# Altium project Power_Box_V2.PrjPcb (part 1 of 2)
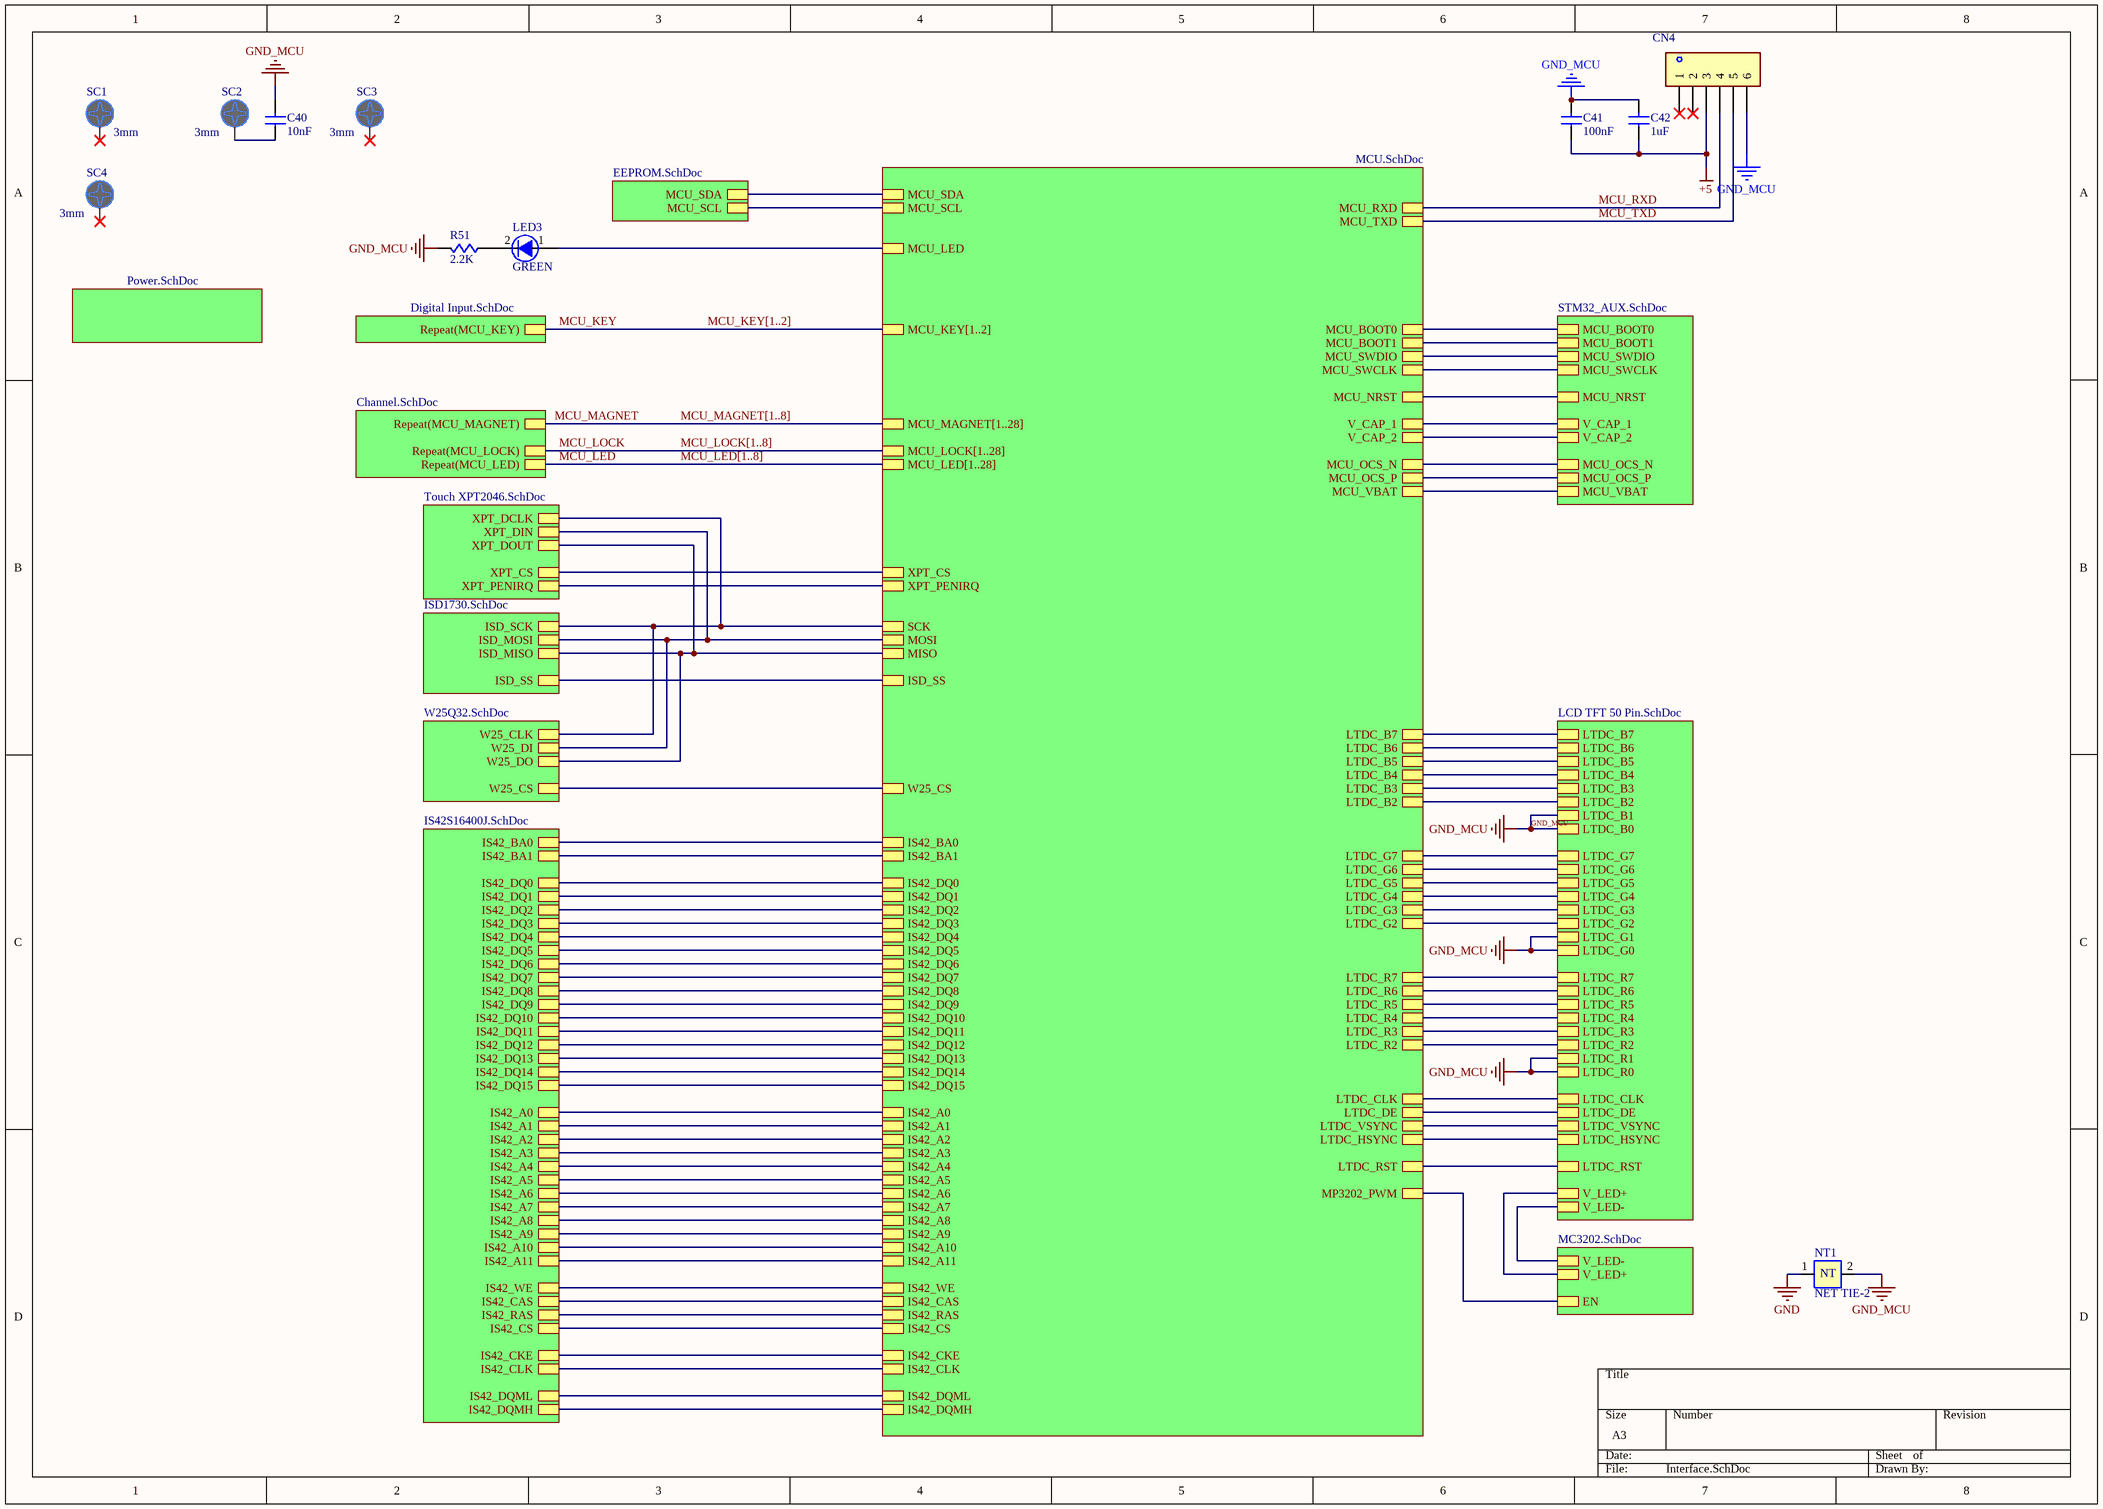
[diagram p0: Interface.SchDoc]
13 sheets, 240 parts. Net scope: hierarchical (ports join the sheet entries above them; power ports are global).
Board file: Power_Box_V2.PcbDoc
Sheets:
  Interface.SchDoc
    MCU = MCU.SchDoc
    STM_AUX = STM32_AUX.SchDoc
    TFT = LCD TFT 50 Pin.SchDoc
    W25Q32 = W25Q32.SchDoc
    EEPROM = EEPROM.SchDoc
    KEY1 = Digital Input.SchDoc
    KEY2 = Digital Input.SchDoc
    Power = Power.SchDoc
    CHANNEL1 = Channel.SchDoc
    CHANNEL2 = Channel.SchDoc
    CHANNEL3 = Channel.SchDoc
    CHANNEL4 = Channel.SchDoc
    CHANNEL5 = Channel.SchDoc
    CHANNEL6 = Channel.SchDoc
    CHANNEL7 = Channel.SchDoc
    CHANNEL8 = Channel.SchDoc
    MC3202 = MC3202.SchDoc
    ISD1730 = ISD1730.SchDoc
    IS42S16400J = IS42S16400J.SchDoc
    XPT2046 = Touch XPT2046.SchDoc

## Sheet Interface.SchDoc
size A3; SheetNumber: 1; SheetTotal: 13

### Parts
C40  value 10nF  [CAP-CER-7x2.5-Ls5]  (hidden comment: CAP Cer 10nF-1KV-X7R-THD)
C41  value 100nF  [C-0805]  (hidden comment: CAP Cer 100nF-50V-X7R-SMD)
C42  value 1uF  [C-0805]  (hidden comment: CAP Cer 1uF-50V-X7R-SMD)
CN4  Connector XH-Straight-THD-2.54mm  [XH-6]  (value not drawn)
LED3  Color: GREEN  [LED-1206-Y]  (hidden comment: LED GREEN-1206-SMD)
NT1  NET TIE-2  [NET TIE-2]  (net tie, no BOM)
R51  value 2.2K  [R-0805]  (hidden comment: RES 2.2K-5%-1/8W-SMD)
SC1  Size: 3mm  [Screw_M3]  (hidden comment: Screw 3mm)
SC2  Size: 3mm  [Screw_M3]  (hidden comment: Screw 3mm)
SC3  Size: 3mm  [Screw_M3]  (hidden comment: Screw 3mm)
SC4  Size: 3mm  [Screw_M3]  (hidden comment: Screw 3mm)

### Sub-sheets
EEPROM = EEPROM.SchDoc: MCU_SDA, MCU_SCL
IS42S16400J = IS42S16400J.SchDoc: IS42_BA0, IS42_BA1, IS42_DQ0, IS42_DQ1, IS42_DQ2, IS42_DQ3, IS42_DQ4, IS42_DQ5, IS42_DQ6, IS42_DQ7, IS42_DQ8, IS42_DQ9, IS42_DQ10, IS42_DQ11, IS42_DQ12, IS42_DQ13, IS42_DQ14, IS42_DQ15, IS42_A0, IS42_A1, IS42_A2, IS42_A3, IS42_A4, IS42_A5, IS42_A6, IS42_A7, IS42_A8, IS42_A9, IS42_A10, IS42_A11, IS42_WE, IS42_CAS, IS42_RAS, IS42_CS, IS42_CKE, IS42_CLK, IS42_DQML, IS42_DQMH
ISD1730 = ISD1730.SchDoc: ISD_SCK, ISD_MOSI, ISD_MISO, ISD_SS
MC3202 = MC3202.SchDoc: V_LED-, V_LED+, EN
MCU = MCU.SchDoc: MCU_BOOT0, MCU_SWCLK, MCU_SWDIO, MCU_NRST, MCU_OCS_N, MCU_OCS_P, MCU_SDA, MCU_SCL, MCU_KEY[1..2], MCU_LOCK[1..28], MCU_LED[1..28], MCU_MAGNET[1..28], MCU_TXD, MCU_RXD, MCU_VBAT, MCU_LED, LTDC_B2, LTDC_B3, LTDC_B4, LTDC_B5, LTDC_B6, LTDC_B7, LTDC_G2, LTDC_G3, LTDC_G4, LTDC_G5, LTDC_G6, LTDC_G7, LTDC_R2, LTDC_R3, LTDC_R4, LTDC_R5, LTDC_R6, LTDC_R7, LTDC_CLK, LTDC_DE, LTDC_VSYNC, LTDC_HSYNC, LTDC_RST, MP3202_PWM, SCK, MOSI, MISO, ISD_SS, W25_CS, IS42_BA0, IS42_BA1, IS42_DQ0, IS42_DQ1, IS42_DQ2, IS42_DQ3, IS42_DQ4, IS42_DQ5, IS42_DQ6, IS42_DQ7, IS42_DQ8, IS42_DQ9, IS42_DQ10, IS42_DQ11, IS42_DQ12, IS42_DQ13, IS42_DQ14, IS42_DQ15, IS42_A0, IS42_A1, IS42_A2, IS42_A3, IS42_A4, IS42_A5, IS42_A6, IS42_A7, IS42_A8, IS42_A9, IS42_A10, IS42_A11, IS42_WE, IS42_CAS, IS42_RAS, IS42_CS, IS42_CKE, IS42_CLK, IS42_DQML, IS42_DQMH, MCU_BOOT1, V_CAP_1, V_CAP_2, XPT_CS, XPT_PENIRQ
Power = Power.SchDoc: no entries
Repeat(CHANNEL, 1, 8) = Channel.SchDoc: Repeat(MCU_LOCK), Repeat(MCU_LED), Repeat(MCU_MAGNET)
Repeat(KEY, 1, 2) = Digital Input.SchDoc: Repeat(MCU_KEY)
STM_AUX = STM32_AUX.SchDoc: MCU_BOOT0, MCU_SWCLK, MCU_SWDIO, MCU_NRST, MCU_OCS_N, MCU_OCS_P, MCU_VBAT, MCU_BOOT1, V_CAP_1, V_CAP_2
TFT = LCD TFT 50 Pin.SchDoc: LTDC_B0, LTDC_B1, LTDC_B2, LTDC_B3, LTDC_B4, LTDC_B5, LTDC_B6, LTDC_B7, LTDC_G0, LTDC_G1, LTDC_G2, LTDC_G3, LTDC_G4, LTDC_G5, LTDC_G6, LTDC_G7, LTDC_R0, LTDC_R1, LTDC_R2, LTDC_R3, LTDC_R4, LTDC_R5, LTDC_R6, LTDC_R7, LTDC_CLK, LTDC_DE, LTDC_VSYNC, LTDC_HSYNC, LTDC_RST, V_LED+, V_LED-
W25Q32 = W25Q32.SchDoc: W25_CLK, W25_DO, W25_DI, W25_CS
XPT2046 = Touch XPT2046.SchDoc: XPT_DCLK, XPT_DIN, XPT_DOUT, XPT_CS, XPT_PENIRQ

### Nets
+5: C41.1 C42.1 CN4.3
GND: NT1.1
GND_MCU: C40.2 C41.2 C42.2 CN4.6 NT1.2 R51.2 ; sheet TFT/LTDC_B0, sheet TFT/LTDC_B1, sheet TFT/LTDC_G0, sheet TFT/LTDC_G1, sheet TFT/LTDC_R0, sheet TFT/LTDC_R1
LTDC_B2: sheet MCU/LTDC_B2, sheet TFT/LTDC_B2
LTDC_B3: sheet MCU/LTDC_B3, sheet TFT/LTDC_B3
LTDC_B4: sheet MCU/LTDC_B4, sheet TFT/LTDC_B4
LTDC_B5: sheet MCU/LTDC_B5, sheet TFT/LTDC_B5
LTDC_B6: sheet MCU/LTDC_B6, sheet TFT/LTDC_B6
LTDC_B7: sheet MCU/LTDC_B7, sheet TFT/LTDC_B7
LTDC_CLK: sheet MCU/LTDC_CLK, sheet TFT/LTDC_CLK
LTDC_DE: sheet MCU/LTDC_DE, sheet TFT/LTDC_DE
LTDC_G2: sheet MCU/LTDC_G2, sheet TFT/LTDC_G2
LTDC_G3: sheet MCU/LTDC_G3, sheet TFT/LTDC_G3
LTDC_G4: sheet MCU/LTDC_G4, sheet TFT/LTDC_G4
LTDC_G5: sheet MCU/LTDC_G5, sheet TFT/LTDC_G5
LTDC_G6: sheet MCU/LTDC_G6, sheet TFT/LTDC_G6
LTDC_G7: sheet MCU/LTDC_G7, sheet TFT/LTDC_G7
LTDC_HSYNC: sheet MCU/LTDC_HSYNC, sheet TFT/LTDC_HSYNC
LTDC_R2: sheet MCU/LTDC_R2, sheet TFT/LTDC_R2
LTDC_R3: sheet MCU/LTDC_R3, sheet TFT/LTDC_R3
LTDC_R4: sheet MCU/LTDC_R4, sheet TFT/LTDC_R4
LTDC_R5: sheet MCU/LTDC_R5, sheet TFT/LTDC_R5
LTDC_R6: sheet MCU/LTDC_R6, sheet TFT/LTDC_R6
LTDC_R7: sheet MCU/LTDC_R7, sheet TFT/LTDC_R7
LTDC_RST: sheet MCU/LTDC_RST, sheet TFT/LTDC_RST
LTDC_VSYNC: sheet MCU/LTDC_VSYNC, sheet TFT/LTDC_VSYNC
MCU_BOOT0: sheet MCU/MCU_BOOT0, sheet STM_AUX/MCU_BOOT0
MCU_BOOT1: sheet MCU/MCU_BOOT1, sheet STM_AUX/MCU_BOOT1
MCU_KEY: sheet Repeat(KEY, 1, 2)/Repeat(MCU_KEY)  [also labelled MCU_KEY[1..2]]
MCU_LED: sheet Repeat(CHANNEL, 1, 8)/Repeat(MCU_LED)
MCU_LOCK: sheet Repeat(CHANNEL, 1, 8)/Repeat(MCU_LOCK)
MCU_MAGNET: sheet Repeat(CHANNEL, 1, 8)/Repeat(MCU_MAGNET)
MCU_NRST: sheet MCU/MCU_NRST, sheet STM_AUX/MCU_NRST
MCU_OCS_N: sheet MCU/MCU_OCS_N, sheet STM_AUX/MCU_OCS_N
MCU_OCS_P: sheet MCU/MCU_OCS_P, sheet STM_AUX/MCU_OCS_P
MCU_RXD: CN4.4 ; sheet MCU/MCU_RXD
MCU_SCL: sheet MCU/MCU_SCL, sheet EEPROM/MCU_SCL
MCU_SDA: sheet MCU/MCU_SDA, sheet EEPROM/MCU_SDA
MCU_SWCLK: sheet MCU/MCU_SWCLK, sheet STM_AUX/MCU_SWCLK
MCU_SWDIO: sheet MCU/MCU_SWDIO, sheet STM_AUX/MCU_SWDIO
MCU_TXD: CN4.5 ; sheet MCU/MCU_TXD
MCU_VBAT: sheet MCU/MCU_VBAT, sheet STM_AUX/MCU_VBAT
V_CAP_1: sheet MCU/V_CAP_1, sheet STM_AUX/V_CAP_1
V_CAP_2: sheet MCU/V_CAP_2, sheet STM_AUX/V_CAP_2
V_LED+: sheet TFT/V_LED+, sheet MC3202/V_LED+
V_LED-: sheet TFT/V_LED-, sheet MC3202/V_LED-
NetC40_1: C40.1 SC2.1
NetLED3_1: LED3.1(A) ; sheet MCU/MCU_LED
NetLED3_2: LED3.2(C) R51.1
NetR53_1: sheet MCU/MP3202_PWM, sheet MC3202/EN
NetR56_1: sheet MCU/W25_CS, sheet W25Q32/W25_CS
NetR59_1: sheet MCU/IS42_CLK, sheet IS42S16400J/IS42_CLK
NetR60_1: sheet MCU/XPT_PENIRQ, sheet XPT2046/XPT_PENIRQ
NetR61_1: sheet MCU/XPT_CS, sheet XPT2046/XPT_CS
NetU2_4: sheet MCU/MISO, sheet W25Q32/W25_DO, sheet ISD1730/ISD_MISO, sheet XPT2046/XPT_DOUT
NetU2_5: sheet MCU/MOSI, sheet W25Q32/W25_DI, sheet ISD1730/ISD_MOSI, sheet XPT2046/XPT_DIN
NetU2_6: sheet MCU/SCK, sheet W25Q32/W25_CLK, sheet ISD1730/ISD_SCK, sheet XPT2046/XPT_DCLK
NetU2_7: sheet MCU/ISD_SS, sheet ISD1730/ISD_SS
NetU3_10: sheet MCU/IS42_A0, sheet IS42S16400J/IS42_A0
NetU3_11: sheet MCU/IS42_A1, sheet IS42S16400J/IS42_A1
NetU3_12: sheet MCU/IS42_A2, sheet IS42S16400J/IS42_A2
NetU3_13: sheet MCU/IS42_A3, sheet IS42S16400J/IS42_A3
NetU3_14: sheet MCU/IS42_A4, sheet IS42S16400J/IS42_A4
NetU3_15: sheet MCU/IS42_A5, sheet IS42S16400J/IS42_A5
NetU3_26: sheet MCU/IS42_WE, sheet IS42S16400J/IS42_WE
NetU3_28: sheet MCU/IS42_CS, sheet IS42S16400J/IS42_CS
NetU3_29: sheet MCU/IS42_CKE, sheet IS42S16400J/IS42_CKE
NetU3_49: sheet MCU/IS42_RAS, sheet IS42S16400J/IS42_RAS
NetU3_50: sheet MCU/IS42_A6, sheet IS42S16400J/IS42_A6
NetU3_53: sheet MCU/IS42_A7, sheet IS42S16400J/IS42_A7
NetU3_54: sheet MCU/IS42_A8, sheet IS42S16400J/IS42_A8
NetU3_55: sheet MCU/IS42_A9, sheet IS42S16400J/IS42_A9
NetU3_56: sheet MCU/IS42_A10, sheet IS42S16400J/IS42_A10
NetU3_57: sheet MCU/IS42_A11, sheet IS42S16400J/IS42_A11
NetU3_58: sheet MCU/IS42_DQ4, sheet IS42S16400J/IS42_DQ4
NetU3_59: sheet MCU/IS42_DQ5, sheet IS42S16400J/IS42_DQ5
NetU3_60: sheet MCU/IS42_DQ6, sheet IS42S16400J/IS42_DQ6
NetU3_63: sheet MCU/IS42_DQ7, sheet IS42S16400J/IS42_DQ7
NetU3_64: sheet MCU/IS42_DQ8, sheet IS42S16400J/IS42_DQ8
NetU3_65: sheet MCU/IS42_DQ9, sheet IS42S16400J/IS42_DQ9
NetU3_66: sheet MCU/IS42_DQ10, sheet IS42S16400J/IS42_DQ10
NetU3_67: sheet MCU/IS42_DQ11, sheet IS42S16400J/IS42_DQ11
NetU3_68: sheet MCU/IS42_DQ12, sheet IS42S16400J/IS42_DQ12
NetU3_77: sheet MCU/IS42_DQ13, sheet IS42S16400J/IS42_DQ13
NetU3_78: sheet MCU/IS42_DQ14, sheet IS42S16400J/IS42_DQ14
NetU3_79: sheet MCU/IS42_DQ15, sheet IS42S16400J/IS42_DQ15
NetU3_85: sheet MCU/IS42_DQ0, sheet IS42S16400J/IS42_DQ0
NetU3_86: sheet MCU/IS42_DQ1, sheet IS42S16400J/IS42_DQ1
NetU3_89: sheet MCU/IS42_BA1, sheet IS42S16400J/IS42_BA1
NetU3_90: sheet MCU/IS42_BA0, sheet IS42S16400J/IS42_BA0
NetU3_114: sheet MCU/IS42_DQ2, sheet IS42S16400J/IS42_DQ2
NetU3_115: sheet MCU/IS42_DQ3, sheet IS42S16400J/IS42_DQ3
NetU3_132: sheet MCU/IS42_CAS, sheet IS42S16400J/IS42_CAS
NetU3_141: sheet MCU/IS42_DQML, sheet IS42S16400J/IS42_DQML
NetU3_142: sheet MCU/IS42_DQMH, sheet IS42S16400J/IS42_DQMH

Not connected (* = marked no-connect by the designer): CN4 1* 2*; SC1 1*; SC3 1*; SC4 1*

### Buses and harness runs
bus MCU_LED[1..8] = sheet MCU/MCU_LED[1..28]
bus MCU_LOCK[1..8] = sheet MCU/MCU_LOCK[1..28]
bus MCU_MAGNET[1..8] = sheet MCU/MCU_MAGNET[1..28]

### Notes on the sheet
- (in symbol NET TIE-2) NT

### Library data of the parts
C40 = CAP-CER: CAPACITOR; Phone Number: 0915 8700 314; Voltage: 1KV; Tolerance: X7R; Type: THD; Publisher: Mahdi Bagherzadeh; ComponentLink1Description: Linkedin; ComponentLink1URL: https://ir.linkedin.com/in/mahdi-bagherzade; Published Date: 9-15-2024
C41 C42 = CAP-CER: CAPACITOR; Phone Number: 0915 8700 314; Voltage: 50V; Tolerance: X7R; Type: SMD; Publisher: Mahdi Bagherzadeh; ComponentLink1Description: Linkedin; ComponentLink1URL: https://ir.linkedin.com/in/mahdi-bagherzade; Published Date: 9-15-2024
CN4 = CN-6pin: CONNECTOR; Phone Number: 0915 8700 314; Value: XH; Publisher: Mahdi Bagherzadeh; ComponentLink1Description: Linkedin; ComponentLink1URL: https://ir.linkedin.com/in/mahdi-bagherzade; Published Date: 9-15-2024; Size: 2.54mm; Type: Straight-THD
LED3 = LED: Phone Number: 0915 8700 314; Type: SMD; Publisher: Mahdi Bagherzadeh; ComponentLink1Description: Linkedin; ComponentLink1URL: https://ir.linkedin.com/in/mahdi-bagherzade; Published Date: 9-15-2024; Size: 1206
NT1 = NET TIE-2: Phone Number: 0915 8700 314; Publisher: Mahdi Bagherzadeh; ComponentLink1Description: Linkedin; ComponentLink1URL: https://ir.linkedin.com/in/mahdi-bagherzade; Published Date: 9-15-2024
R51 = RES: RESISTOR; Phone Number: 0915 8700 314; Tolerance: 5%; Power: 1/8W; Publisher: Mahdi Bagherzadeh; ComponentLink1Description: Linkedin; ComponentLink1URL: https://ir.linkedin.com/in/mahdi-bagherzade; Published Date: 9-15-2024; Type: SMD
SC1-SC4 = SCREW: Phone Number: 0915 8700 314; Publisher: Mahdi Bagherzadeh; ComponentLink1Description: Linkedin; ComponentLink1URL: https://ir.linkedin.com/in/mahdi-bagherzade; Published Date: 9-15-2024

## Sheet MCU.SchDoc
size A3; SheetNumber: 7; SheetTotal: 13
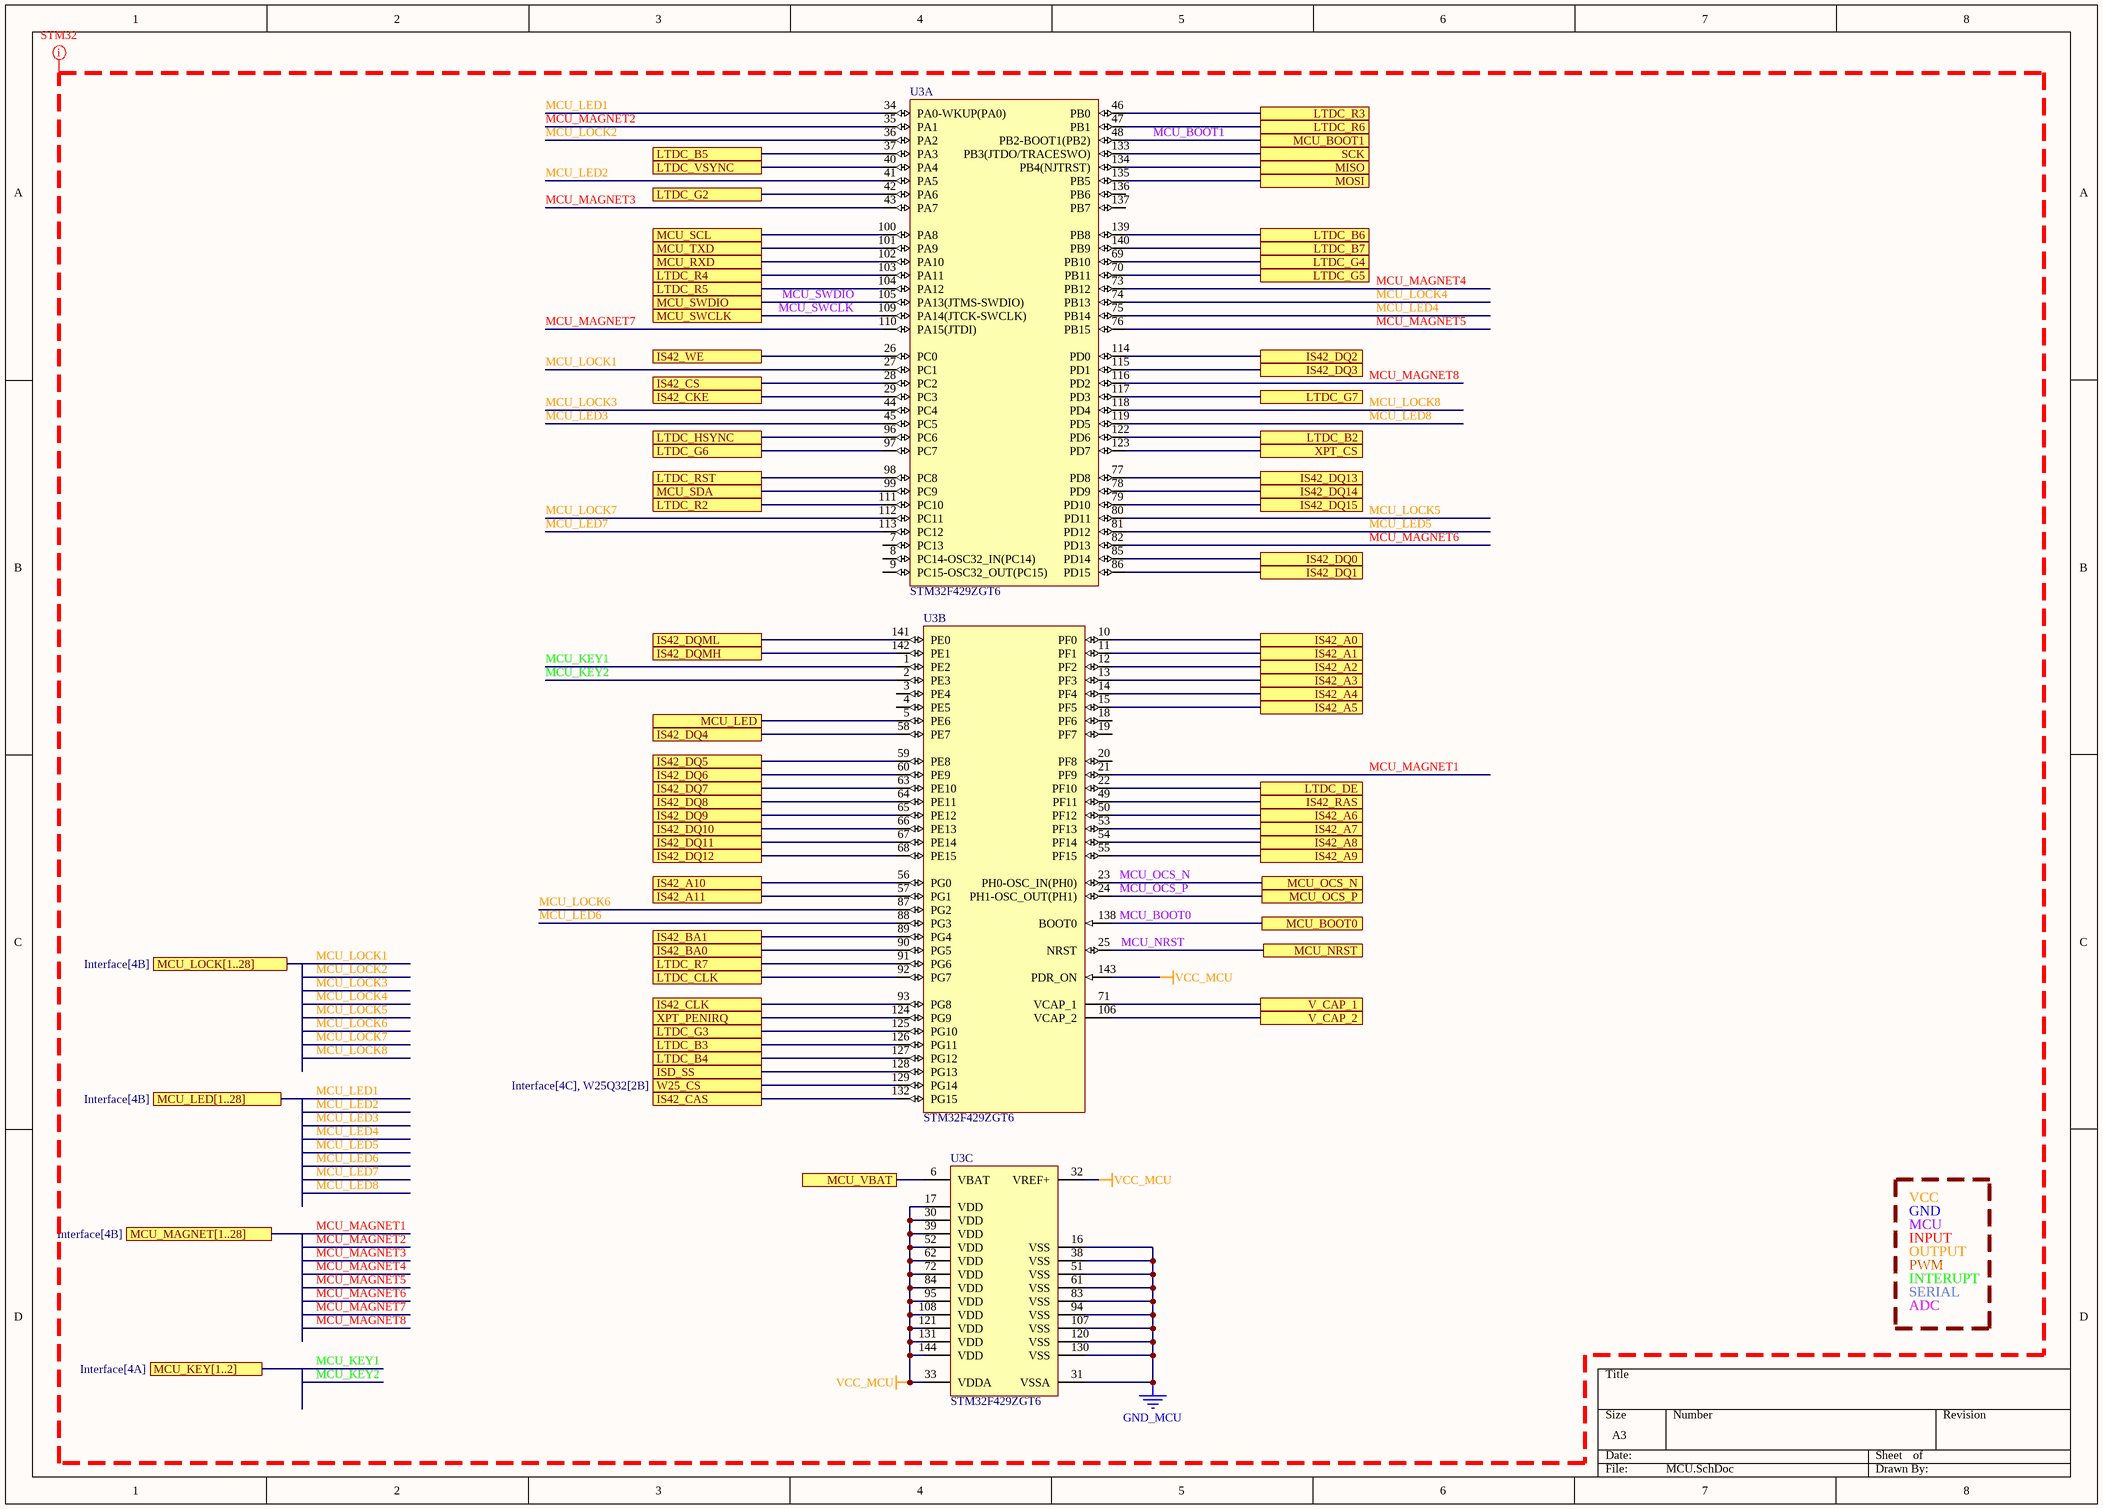
[diagram p1: MCU.SchDoc]

### Parts
U3  STM32F429ZGT6  [STM-LQFP144_N]  (parts A,B,C of 3)

### Ports
IS42_A0 (see Interface[4C], IS42S16400J[3B]), IS42_A1 (see Interface[4C], IS42S16400J[3B]), IS42_A2 (see Interface[4D], IS42S16400J[3B]), IS42_A3 (see Interface[4D], IS42S16400J[3B]), IS42_A4 (see Interface[4D], IS42S16400J[3B]), IS42_A5 (see Interface[4D], IS42S16400J[3B]), IS42_A6 (see Interface[4D], IS42S16400J[3B]), IS42_A7 (see Interface[4D], IS42S16400J[3B]), IS42_A8 (see Interface[4D], IS42S16400J[3B]), IS42_A9 (see Interface[4D], IS42S16400J[3C]), IS42_A10 (see Interface[4D], IS42S16400J[3C]), IS42_A11 (see Interface[4D], IS42S16400J[3C]), IS42_BA0 (see Interface[4C], IS42S16400J[1B]), IS42_BA1 (see Interface[4C], IS42S16400J[1B]), IS42_CAS (see Interface[4D], IS42S16400J[3C]), IS42_CKE (see Interface[4D], IS42S16400J[3C]), IS42_CLK (see Interface[4D], IS42S16400J[3C]), IS42_CS (see Interface[4D], IS42S16400J[3C]), IS42_DQ0 (see Interface[4C], IS42S16400J[1B]), IS42_DQ1 (see Interface[4C], IS42S16400J[1B]), IS42_DQ2 (see Interface[4C], IS42S16400J[1B]), IS42_DQ3 (see Interface[4C], IS42S16400J[1B]), IS42_DQ4 (see Interface[4C], IS42S16400J[1B]), IS42_DQ5 (see Interface[4C], IS42S16400J[1B]), IS42_DQ6 (see Interface[4C], IS42S16400J[1C]), IS42_DQ7 (see Interface[4C], IS42S16400J[1C]), IS42_DQ8 (see Interface[4C], IS42S16400J[1C]), IS42_DQ9 (see Interface[4C], IS42S16400J[1C]), IS42_DQ10 (see Interface[4C], IS42S16400J[1C]), IS42_DQ11 (see Interface[4C], IS42S16400J[1C]), IS42_DQ12 (see Interface[4C], IS42S16400J[1C]), IS42_DQ13 (see Interface[4C], IS42S16400J[1C]), IS42_DQ14 (see Interface[4C], IS42S16400J[1C]), IS42_DQ15 (see Interface[4C], IS42S16400J[1C]), IS42_DQMH (see Interface[4D], IS42S16400J[3C]), IS42_DQML (see Interface[4D], IS42S16400J[3C]), IS42_RAS (see Interface[4D], IS42S16400J[3C]), IS42_WE (see Interface[4D], IS42S16400J[3C]), ISD_SS (see Interface[4B], ISD1730[1B]), LTDC_B2 (see Interface[6C], LCD TFT 50 Pin[3B]), LTDC_B3 (see Interface[6C], LCD TFT 50 Pin[3B]), LTDC_B4 (see Interface[6C], LCD TFT 50 Pin[3B]), LTDC_B5 (see Interface[6C], LCD TFT 50 Pin[3A]), LTDC_B6 (see Interface[6B], LCD TFT 50 Pin[3A]), LTDC_B7 (see Interface[6B], LCD TFT 50 Pin[3A]), LTDC_CLK (see Interface[6C], LCD TFT 50 Pin[3C]), LTDC_DE (see Interface[6C], LCD TFT 50 Pin[3C]), LTDC_G2 (see Interface[6C], LCD TFT 50 Pin[3B]), LTDC_G3 (see Interface[6C], LCD TFT 50 Pin[3B]), LTDC_G4 (see Interface[6C], LCD TFT 50 Pin[3B]), LTDC_G5 (see Interface[6C], LCD TFT 50 Pin[3B]), LTDC_G6 (see Interface[6C], LCD TFT 50 Pin[3B]), LTDC_G7 (see Interface[6C], LCD TFT 50 Pin[3B]), LTDC_HSYNC (see Interface[6D], LCD TFT 50 Pin[3C]), LTDC_R2 (see Interface[6C], LCD TFT 50 Pin[3C]), LTDC_R3 (see Interface[6C], LCD TFT 50 Pin[3C]), LTDC_R4 (see Interface[6C], LCD TFT 50 Pin[3B]), LTDC_R5 (see Interface[6C], LCD TFT 50 Pin[3B]), LTDC_R6 (see Interface[6C], LCD TFT 50 Pin[3B]), LTDC_R7 (see Interface[6C], LCD TFT 50 Pin[3B]), LTDC_RST (see Interface[6D], LCD TFT 50 Pin[3C]), LTDC_VSYNC (see Interface[6C], LCD TFT 50 Pin[3C]), MCU_BOOT0 (see Interface[6A], STM32_AUX[2B]), MCU_BOOT1 (see Interface[6A], STM32_AUX[2A]), MCU_KEY[1..2] (see Interface[4A]), MCU_LED (see Interface[4A]), MCU_LED[1..28] (see Interface[4B]), MCU_LOCK[1..28] (see Interface[4B]), MCU_MAGNET[1..28] (see Interface[4B]), MCU_NRST (see Interface[6B], STM32_AUX[3A]), MCU_OCS_N (see Interface[6B], STM32_AUX[4A]), MCU_OCS_P (see Interface[6B], STM32_AUX[4A]), MCU_RXD (see Interface[6A]), MCU_SCL (see Interface[4A], EEPROM[3B]), MCU_SDA (see Interface[4A], EEPROM[3B]), MCU_SWCLK (see Interface[6A], STM32_AUX[2B]), MCU_SWDIO (see Interface[6A], STM32_AUX[2B]), MCU_TXD (see Interface[6A]), MCU_VBAT (see Interface[6B], STM32_AUX[1D]), MISO (see Interface[4B]), MOSI (see Interface[4B]), SCK (see Interface[4B]), V_CAP_1 (see Interface[6B], STM32_AUX[3C]), V_CAP_2 (see Interface[6B], STM32_AUX[3C]), W25_CS (see Interface[4C], W25Q32[2B]), XPT_CS (see Interface[4B], Touch XPT2046[3C]), XPT_PENIRQ (see Interface[4B], Touch XPT2046[3C])

### Nets
GND_MCU: U3.16(VSS) U3.31(VSSA) U3.38(VSS) U3.51(VSS) U3.61(VSS) U3.83(VSS) U3.94(VSS) U3.107(VSS) U3.120(VSS) U3.130(VSS)
VCC_MCU: U3.17(VDD) U3.30(VDD) U3.32(VREF+) U3.33(VDDA) U3.39(VDD) U3.52(VDD) U3.62(VDD) U3.72(VDD) U3.84(VDD) U3.95(VDD) U3.108(VDD) U3.121(VDD) U3.131(VDD) U3.143(PDR_ON) U3.144(VDD)
LTDC_B2: U3.122(PD6) ; port LTDC_B2
LTDC_B3: U3.126(PG11) ; port LTDC_B3
LTDC_B4: U3.127(PG12) ; port LTDC_B4
LTDC_B5: U3.37(PA3) ; port LTDC_B5
LTDC_B6: U3.139(PB8) ; port LTDC_B6
LTDC_B7: U3.140(PB9) ; port LTDC_B7
LTDC_CLK: U3.92(PG7) ; port LTDC_CLK
LTDC_DE: U3.22(PF10) ; port LTDC_DE
LTDC_G2: U3.42(PA6) ; port LTDC_G2
LTDC_G3: U3.125(PG10) ; port LTDC_G3
LTDC_G4: U3.69(PB10) ; port LTDC_G4
LTDC_G5: U3.70(PB11) ; port LTDC_G5
LTDC_G6: U3.97(PC7) ; port LTDC_G6
LTDC_G7: U3.117(PD3) ; port LTDC_G7
LTDC_HSYNC: U3.96(PC6) ; port LTDC_HSYNC
LTDC_R2: U3.111(PC10) ; port LTDC_R2
LTDC_R3: U3.46(PB0) ; port LTDC_R3
LTDC_R4: U3.103(PA11) ; port LTDC_R4
LTDC_R5: U3.104(PA12) ; port LTDC_R5
LTDC_R6: U3.47(PB1) ; port LTDC_R6
LTDC_R7: U3.91(PG6) ; port LTDC_R7
LTDC_RST: U3.98(PC8) ; port LTDC_RST
LTDC_VSYNC: U3.40(PA4) ; port LTDC_VSYNC
MCU_BOOT0: U3.138(BOOT0) ; port MCU_BOOT0
MCU_BOOT1: U3.48(PB2-BOOT1(PB2)) ; port MCU_BOOT1
MCU_KEY1: U3.1(PE2)
MCU_KEY2: U3.2(PE3)
MCU_LED1: U3.34(PA0-WKUP(PA0))
MCU_LED2: U3.41(PA5)
MCU_LED3: U3.45(PC5)
MCU_LED4: U3.75(PB14)
MCU_LED5: U3.81(PD12)
MCU_LED6: U3.88(PG3)
MCU_LED7: U3.113(PC12)
MCU_LED8: U3.119(PD5)
MCU_LOCK1: U3.27(PC1)
MCU_LOCK2: U3.36(PA2)
MCU_LOCK3: U3.44(PC4)
MCU_LOCK4: U3.74(PB13)
MCU_LOCK5: U3.80(PD11)
MCU_LOCK6: U3.87(PG2)
MCU_LOCK7: U3.112(PC11)
MCU_LOCK8: U3.118(PD4)
MCU_MAGNET1: U3.21(PF9)
MCU_MAGNET2: U3.35(PA1)
MCU_MAGNET3: U3.43(PA7)
MCU_MAGNET4: U3.73(PB12)
MCU_MAGNET5: U3.76(PB15)
MCU_MAGNET6: U3.82(PD13)
MCU_MAGNET7: U3.110(PA15(JTDI))
MCU_MAGNET8: U3.116(PD2)
MCU_NRST: U3.25(NRST) ; port MCU_NRST
MCU_OCS_N: U3.23(PH0-OSC_IN(PH0)) ; port MCU_OCS_N
MCU_OCS_P: U3.24(PH1-OSC_OUT(PH1)) ; port MCU_OCS_P
MCU_RXD: U3.102(PA10) ; port MCU_RXD
MCU_SCL: U3.100(PA8) ; port MCU_SCL
MCU_SDA: U3.99(PC9) ; port MCU_SDA
MCU_SWCLK: U3.109(PA14(JTCK-SWCLK)) ; port MCU_SWCLK
MCU_SWDIO: U3.105(PA13(JTMS-SWDIO)) ; port MCU_SWDIO
MCU_TXD: U3.101(PA9) ; port MCU_TXD
MCU_VBAT: U3.6(VBAT) ; port MCU_VBAT
V_CAP_1: U3.71(VCAP_1) ; port V_CAP_1
V_CAP_2: U3.106(VCAP_2) ; port V_CAP_2
NetLED3_1: U3.5(PE6) ; port MCU_LED
NetR56_1: U3.129(PG14) ; port W25_CS
NetR59_1: U3.93(PG8) ; port IS42_CLK
NetR60_1: U3.124(PG9) ; port XPT_PENIRQ
NetR61_1: U3.123(PD7) ; port XPT_CS
NetU2_4: U3.134(PB4(NJTRST)) ; port MISO
NetU2_5: U3.135(PB5) ; port MOSI
NetU2_6: U3.133(PB3(JTDO/TRACESWO)) ; port SCK
NetU2_7: U3.128(PG13) ; port ISD_SS
NetU3_10: U3.10(PF0) ; port IS42_A0
NetU3_11: U3.11(PF1) ; port IS42_A1
NetU3_12: U3.12(PF2) ; port IS42_A2
NetU3_13: U3.13(PF3) ; port IS42_A3
NetU3_14: U3.14(PF4) ; port IS42_A4
NetU3_15: U3.15(PF5) ; port IS42_A5
NetU3_26: U3.26(PC0) ; port IS42_WE
NetU3_28: U3.28(PC2) ; port IS42_CS
NetU3_29: U3.29(PC3) ; port IS42_CKE
NetU3_49: U3.49(PF11) ; port IS42_RAS
NetU3_50: U3.50(PF12) ; port IS42_A6
NetU3_53: U3.53(PF13) ; port IS42_A7
NetU3_54: U3.54(PF14) ; port IS42_A8
NetU3_55: U3.55(PF15) ; port IS42_A9
NetU3_56: U3.56(PG0) ; port IS42_A10
NetU3_57: U3.57(PG1) ; port IS42_A11
NetU3_58: U3.58(PE7) ; port IS42_DQ4
NetU3_59: U3.59(PE8) ; port IS42_DQ5
NetU3_60: U3.60(PE9) ; port IS42_DQ6
NetU3_63: U3.63(PE10) ; port IS42_DQ7
NetU3_64: U3.64(PE11) ; port IS42_DQ8
NetU3_65: U3.65(PE12) ; port IS42_DQ9
NetU3_66: U3.66(PE13) ; port IS42_DQ10
NetU3_67: U3.67(PE14) ; port IS42_DQ11
NetU3_68: U3.68(PE15) ; port IS42_DQ12
NetU3_77: U3.77(PD8) ; port IS42_DQ13
NetU3_78: U3.78(PD9) ; port IS42_DQ14
NetU3_79: U3.79(PD10) ; port IS42_DQ15
NetU3_85: U3.85(PD14) ; port IS42_DQ0
NetU3_86: U3.86(PD15) ; port IS42_DQ1
NetU3_89: U3.89(PG4) ; port IS42_BA1
NetU3_90: U3.90(PG5) ; port IS42_BA0
NetU3_114: U3.114(PD0) ; port IS42_DQ2
NetU3_115: U3.115(PD1) ; port IS42_DQ3
NetU3_132: U3.132(PG15) ; port IS42_CAS
NetU3_141: U3.141(PE0) ; port IS42_DQML
NetU3_142: U3.142(PE1) ; port IS42_DQMH

Not connected (* = marked no-connect by the designer): U3 3(PE4) 4(PE5) 7(PC13) 8(PC14-OSC32_IN(PC14)) 9(PC15-OSC32_OUT(PC15)) 18(PF6) 19(PF7) 20(PF8) 136(PB6) 137(PB7)

### Layout directives
net class STM32: GND_MCU, MCU_BOOT0, MCU_BOOT1, MCU_KEY1, MCU_KEY2, MCU_LED1, MCU_LED2, MCU_LED3, MCU_LED4, MCU_LED5, MCU_LED6, MCU_LED7, MCU_LED8, MCU_LOCK1, MCU_LOCK2, MCU_LOCK3, MCU_LOCK4, MCU_LOCK5, MCU_LOCK6, MCU_LOCK7, MCU_LOCK8, MCU_MAGNET1, MCU_MAGNET2, MCU_MAGNET3, MCU_MAGNET4, MCU_MAGNET5, MCU_MAGNET6, MCU_MAGNET7, MCU_MAGNET8, MCU_NRST, MCU_OCS_N, MCU_OCS_P, MCU_SWCLK, MCU_SWDIO, VCC_MCU

### Notes on the sheet
- INPUT
- OUTPUT
- MCU
- GND
- VCC
- INTERUPT
- SERIAL
- ADC
- PWM

### Library data of the parts
U3 = STM32F429ZGT6: ARM Cortex-M4 32-bit MCU+FPU, 225 DMIPS, 1024 kB Flash, 256 kB Internal RAM, 114 I/Os, 144-pin LQFP, -40 to 85 degC, Tray; Manufacturer: STMicroelectronics; D/A Converter: 2x12-bit; FLASH Size (Prog) (kB): 1024; I/Os (High Current): 114; Internal RAM Size (kB): 256; Operating Frequency(F) (Processor speed) (MHz): 180; Supply Voltage(Vcc) max (V): 3.6; Supply Voltage(Vcc) min (V): 1.8; DatasheetVersion: Rev. 2; PackageVersion: Rev. 4, 06/2013; PackageReference: LQFP144; PackageDescription: 144-Pin Low Profile Quad Flat Package, 20 x 20 mm Body, 0.5 mm Pitch; Supplier 1: Digi-Key; Supplier Part Number 1: STM32F429ZGT6-ND; Supplier 2: Newark; Supplier Part Number 2: 06X3675; Supplier 3: Mouser; Supplier Part Number 3: 511-STM32F429ZGT6; Core: ARM Cortex-M4; Packing: Tray; Mounting Technology: Surface Mount; PartNumber: STM32F429ZGT6; ComponentLink1Description: Manufacturer URL; ComponentLink1URL: http://www.st.com/web/en/home.html; ComponentLink2Description: Datasheet; ComponentLink2URL: http://www.st.com/st-web-ui/static/active/en/resource/technical/document/data_brief/DM00053488.pdf; ComponentLink3Description: Package Specification; ComponentLink3URL: http://www.st.com/st-web-ui/static/active/en/resource/technical/document/datasheet/DM00037051.pdf

## Sheet STM32_AUX.SchDoc
size A4; SheetNumber: 8; SheetTotal: 13
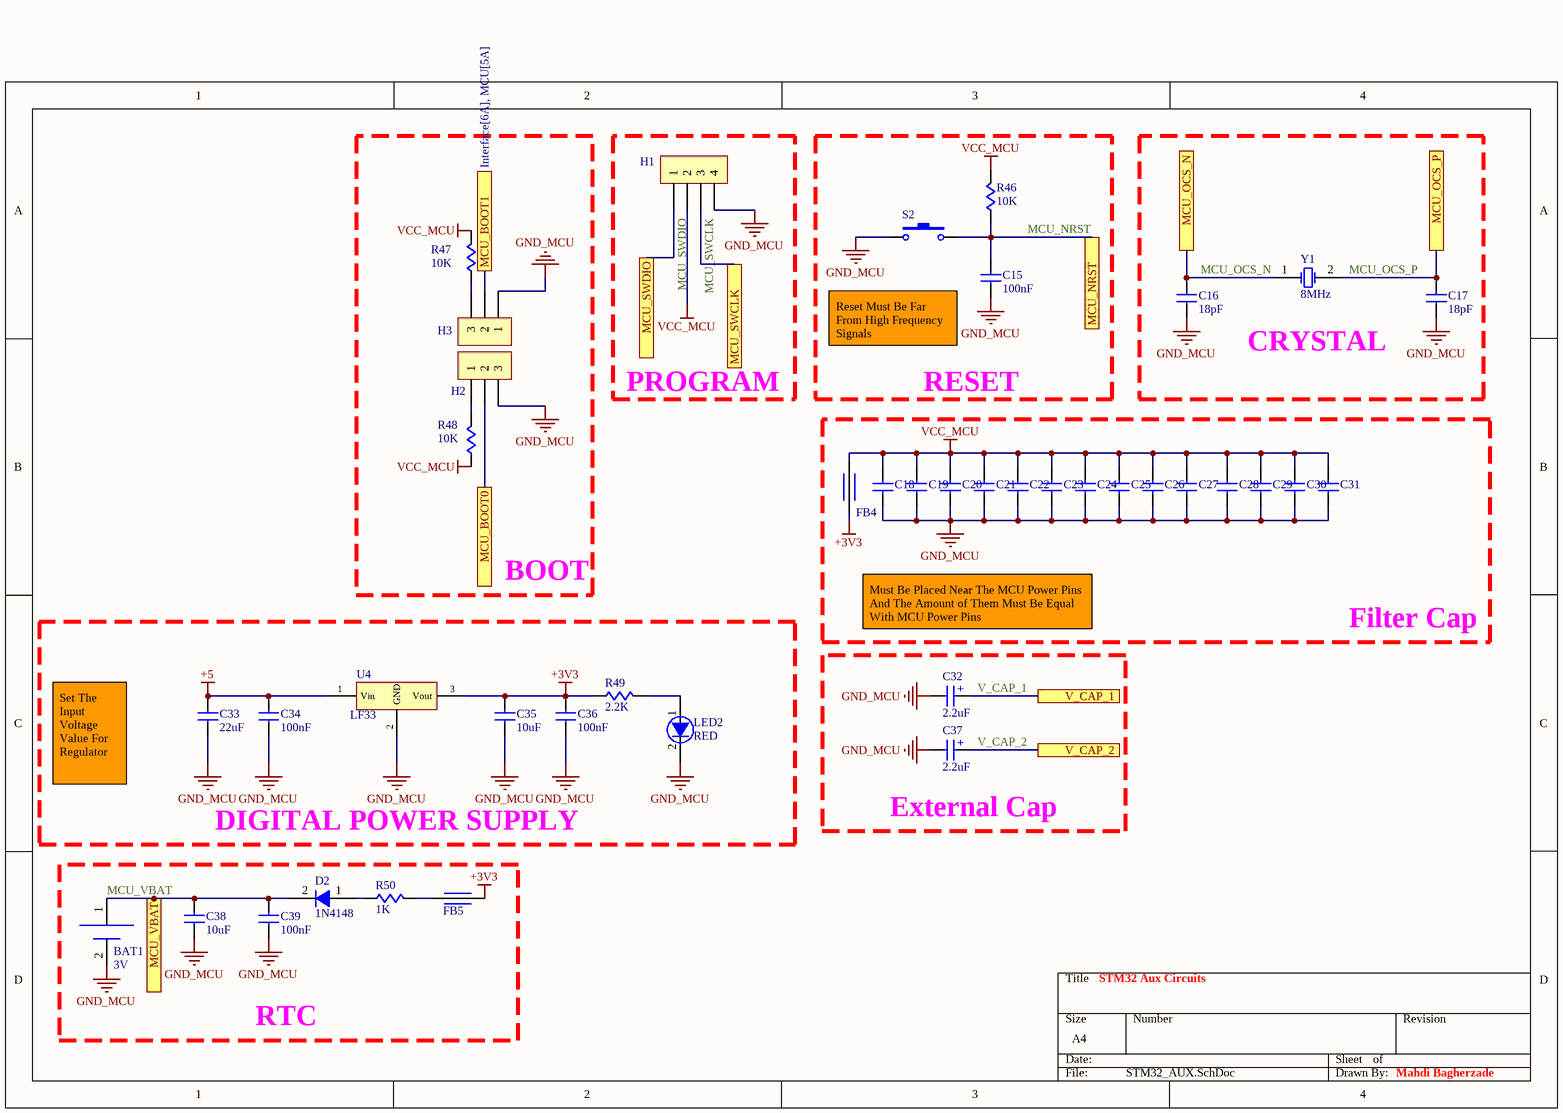
[diagram p2: STM32_AUX.SchDoc]

### Parts
BAT1  Voltage: 3V  [BAT-HOLDER-SMD-1220]  (hidden comment: Bat Holder 2016-SMD)
C15  value 100nF  [C-0805]  (hidden comment: CAP Cer 100nF-50V-X7R-SMD)
C16  value 18pF  [C-0805]  (hidden comment: CAP Cer 18pF-50V-X7R-SMD)
C17  value 18pF  [C-0805]  (hidden comment: CAP Cer 18pF-50V-X7R-SMD)
C18  CAP Cer 100nF-50V-X7R-SMD  [C-0805]  (value not drawn)
C19  CAP Cer 100nF-50V-X7R-SMD  [C-0805]  (value not drawn)
C20  CAP Cer 100nF-50V-X7R-SMD  [C-0805]  (value not drawn)
C21  CAP Cer 100nF-50V-X7R-SMD  [C-0805]  (value not drawn)
C22  CAP Cer 100nF-50V-X7R-SMD  [C-0805]  (value not drawn)
C23  CAP Cer 100nF-50V-X7R-SMD  [C-0805]  (value not drawn)
C24  CAP Cer 100nF-50V-X7R-SMD  [C-0805]  (value not drawn)
C25  CAP Cer 100nF-50V-X7R-SMD  [C-0805]  (value not drawn)
C26  CAP Cer 100nF-50V-X7R-SMD  [C-0805]  (value not drawn)
C27  CAP Cer 100nF-50V-X7R-SMD  [C-0805]  (value not drawn)
C28  CAP Cer 100nF-50V-X7R-SMD  [C-0805]  (value not drawn)
C29  CAP Cer 100nF-50V-X7R-SMD  [C-0805]  (value not drawn)
C30  CAP Cer 100nF-50V-X7R-SMD  [C-0805]  (value not drawn)
C31  CAP Cer 100nF-50V-X7R-SMD  [C-0805]  (value not drawn)
C32  value 2.2uF  [TAN-A]  (hidden comment: CAP Tantal 2.2uF-10V-A-SMD)
C33  value 22uF  [C-0805]  (hidden comment: CAP Cer 22uF-50V-X7R-SMD)
C34  value 100nF  [C-0805]  (hidden comment: CAP Cer 100nF-50V-X7R-SMD)
C35  value 10uF  [C-0805]  (hidden comment: CAP Cer 10uF-50V-X7R-SMD)
C36  value 100nF  [C-0805]  (hidden comment: CAP Cer 100nF-50V-X7R-SMD)
C37  value 2.2uF  [TAN-A]  (hidden comment: CAP Tantal 2.2uF-10V-A-SMD)
C38  value 10uF  [C-0805]  (hidden comment: CAP Cer 10uF-50V-X7R-SMD)
C39  value 100nF  [C-0805]  (hidden comment: CAP Cer 100nF-50V-X7R-SMD)
D2  Code: 1N4148  [SOD80]  (hidden comment: Diode 1N4148-SMD)
FB4  FERRITE BEAD  [FB-0805]  (value not drawn)
FB5  Ferrite Bead SMD  [FB-0805]  (value not drawn)
H1  Header 4x1 Pin -Straight-Male-2.54mm  [H-4pin-M-S]  (value not drawn)
H2  Header 3x1 Pin -Straight-Male-2.54mm  [H-3pin-M-S]  (value not drawn)
H3  Header 3x1 Pin -Straight-Male-2.54mm  [H-3pin-M-S]  (value not drawn)
LED2  Color: RED  [LED-1206-R]  (hidden comment: LED RED-1206-SMD)
R46  value 10K  [R-0805]  (hidden comment: RES 10K-5%-1/8W-SMD)
R47  value 10K  [R-0805]  (hidden comment: RES 10K-5%-1/8W-SMD)
R48  value 10K  [R-0805]  (hidden comment: RES 10K-5%-1/8W-SMD)
R49  value 2.2K  [R-0805]  (hidden comment: RES 2.2K-5%-1/8W-SMD)
R50  value 1K  [R-0805]  (hidden comment: RES 1K-5%-1/8W-SMD)
S2  Push Button 3x6mm-2Pin-SMD  [SW-SMD-2pin-3x6]  (value not drawn)
U4  Reg LF33-3.3V-SMD  [TO252-3pin]  (value not drawn)
Y1  value 8MHz  [CRYSTAL-SMD]  (hidden comment: Crystal 8MHz-SMD)

### Blocks framed on the sheet
BOOT: H2 H3 R47 R48
PROGRAM: H1
RESET: C15 R46 S2
CRYSTAL: C16 C17 Y1
Filter Cap: C18-C31 FB4
DIGITAL POWER SUPPLY: C33-C36 LED2 R49 U4
External Cap: C32 C37
RTC: BAT1 C38 C39 D2 FB5 R50

### Ports
MCU_BOOT0 (see Interface[6A], MCU[5C]), MCU_BOOT1 (see Interface[6A], MCU[5A]), MCU_NRST (see Interface[6B], MCU[5C]), MCU_OCS_N (see Interface[6B], MCU[5C]), MCU_OCS_P (see Interface[6B], MCU[5C]), MCU_SWCLK (see Interface[6A], MCU[3A]), MCU_SWDIO (see Interface[6A], MCU[3A]), MCU_VBAT (see Interface[6B], MCU[4D]), V_CAP_1 (see Interface[6B], MCU[5C]), V_CAP_2 (see Interface[6B], MCU[5C])

### Nets
+3V3: C35.2 C36.2 FB4.1 FB5.1 R49.1 U4.3(Vout)
+5: C33.2 C34.2 U4.1(Vin)
GND_MCU: BAT1.2(-) C15.1 C16.1 C17.1 C18.2 C19.2 C20.2 C21.2 C22.2 C23.2 C24.2 C25.2 C26.2 C27.2 C28.2 C29.2 C30.2 C31.2 C32.2 C33.1 C34.1 C35.1 C36.1 C37.2 C38.1 C39.1 H1.4 H2.3 H3.1 LED2.2(C) S2.1 U4.2(GND)
VCC_MCU: C18.1 C19.1 C20.1 C21.1 C22.1 C23.1 C24.1 C25.1 C26.1 C27.1 C28.1 C29.1 C30.1 C31.1 FB4.2 H1.2 R46.2 R47.1 R48.1
MCU_BOOT0: H2.2 ; port MCU_BOOT0
MCU_BOOT1: H3.2 ; port MCU_BOOT1
MCU_NRST: C15.2 R46.1 S2.2 ; port MCU_NRST
MCU_OCS_N: C16.2 Y1.1(OSC1) ; port MCU_OCS_N
MCU_OCS_P: C17.2 Y1.2(OSC2) ; port MCU_OCS_P
MCU_SWCLK: H1.3 ; port MCU_SWCLK
MCU_SWDIO: H1.1 ; port MCU_SWDIO
MCU_VBAT: BAT1.1(+) C38.2 C39.2 D2.2(C) ; port MCU_VBAT
V_CAP_1: C32.1 ; port V_CAP_1
V_CAP_2: C37.1 ; port V_CAP_2
NetD2_1: D2.1(A) R50.1
NetFB5_2: FB5.2 R50.2
NetH2_1: H2.1 R48.2
NetH3_3: H3.3 R47.2
NetLED2_1: LED2.1(A) R49.2

### Notes on the sheet
- Reset Must Be Far From High Frequency Signals
- Must Be Placed Near The MCU Power Pins And The Amount of Them Must Be Equal With MCU Power Pins
- Set The Input Voltage Value For Regulator
- STM32 Aux Circuits
- Mahdi Bagherzade
- (in symbol CAP-TAN) +

### Library data of the parts
BAT1 = BATTERY HOLDER: BATTERY; Phone Number: 0915 8700 314; Publisher: Mahdi Bagherzadeh; ComponentLink1Description: Linkedin; ComponentLink1URL: https://ir.linkedin.com/in/mahdi-bagherzade; Published Date: 9-15-2024; Size: 2016; Type: SMD
C15-C17 C33-C36 C38 C39 = CAP-CER: as C41 on sheet Interface; Publisher: Mahdi Bagherzadeh; ComponentLink1Description: Linkedin; ComponentLink1URL: https://ir.linkedin.com/in/mahdi-bagherzade; Published Date: 9-15-2024
C18-C31 = CAP-CER: CAPACITOR; Phone Number: 0915 8700 314; Voltage: 50V; Tolerance: X7R; Type: SMD; Value: 100nF; Publisher: Mahdi Bagherzadeh; ComponentLink1Description: Linkedin; ComponentLink1URL: https://ir.linkedin.com/in/mahdi-bagherzade; Published Date: 9-15-2024
C32 C37 = CAP-TAN: CAPACITOR; Phone Number: 0915 8700 314; Voltage: 10V; Type: SMD; Publisher: Mahdi Bagherzadeh; ComponentLink1Description: Linkedin; ComponentLink1URL: https://ir.linkedin.com/in/mahdi-bagherzade; Published Date: 9-15-2024; Size: A
D2 = DIODE: Phone Number: 0915 8700 314; Type: SMD; Publisher: Mahdi Bagherzadeh; ComponentLink1Description: Linkedin; ComponentLink1URL: https://ir.linkedin.com/in/mahdi-bagherzade; Published Date: 9-15-2024
FB4 FB5 = FERRITE BEAD: INDUCATOR; Phone Number: 0915 8700 314; Publisher: Mahdi Bagherzadeh; ComponentLink1Description: Linkedin; ComponentLink1URL: https://ir.linkedin.com/in/mahdi-bagherzade; Published Date: 9-15-2024
  FB5: Type: SMD
H1 = HEADER-4pin: HEADER; Phone Number: 0915 8700 314; Publisher: Mahdi Bagherzadeh; ComponentLink1Description: Linkedin; ComponentLink1URL: https://ir.linkedin.com/in/mahdi-bagherzade; Published Date: 9-15-2024; Type: Straight-Male; Size: 2.54mm
H2 H3 = HEADER-3pin: HEADER; Phone Number: 0915 8700 314; Publisher: Mahdi Bagherzadeh; ComponentLink1Description: Linkedin; ComponentLink1URL: https://ir.linkedin.com/in/mahdi-bagherzade; Published Date: 9-15-2024; Type: Straight-Male; Size: 2.54mm
LED2 = LED: Phone Number: 0915 8700 314; Type: SMD; Publisher: Mahdi Bagherzadeh; ComponentLink1Description: Linkedin; ComponentLink1URL: https://ir.linkedin.com/in/mahdi-bagherzade; Published Date: 9-15-2024; Size: 1206
R46-R50 = RES: as R51 on sheet Interface; Publisher: Mahdi Bagherzadeh; ComponentLink1Description: Linkedin; ComponentLink1URL: https://ir.linkedin.com/in/mahdi-bagherzade; Published Date: 9-15-2024; Type: SMD
S2 = PUSH BUTTON: SWITCH; Phone Number: 0915 8700 314; Publisher: Mahdi Bagherzadeh; ComponentLink1Description: Linkedin; ComponentLink1URL: https://ir.linkedin.com/in/mahdi-bagherzade; Published Date: 9-15-2024; Size: 3x6mm; Type: 2Pin-SMD
U4 = LF33: REGULATOR; Phone Number: 0915 8700 314; Voltage: 3.3V; Publisher: Mahdi Bagherzadeh; ComponentLink1Description: Linkedin; ComponentLink1URL: https://ir.linkedin.com/in/mahdi-bagherzade; Published Date: 9-15-2024; Type: SMD; Code: LF33
Y1 = CRYSTAL: Phone Number: 0915 8700 314; Publisher: Mahdi Bagherzadeh; ComponentLink1Description: Linkedin; ComponentLink1URL: https://ir.linkedin.com/in/mahdi-bagherzade; Published Date: 9-15-2024; Type: SMD

## Sheet LCD TFT 50 Pin.SchDoc
size A; SheetNumber: 6; SheetTotal: 13
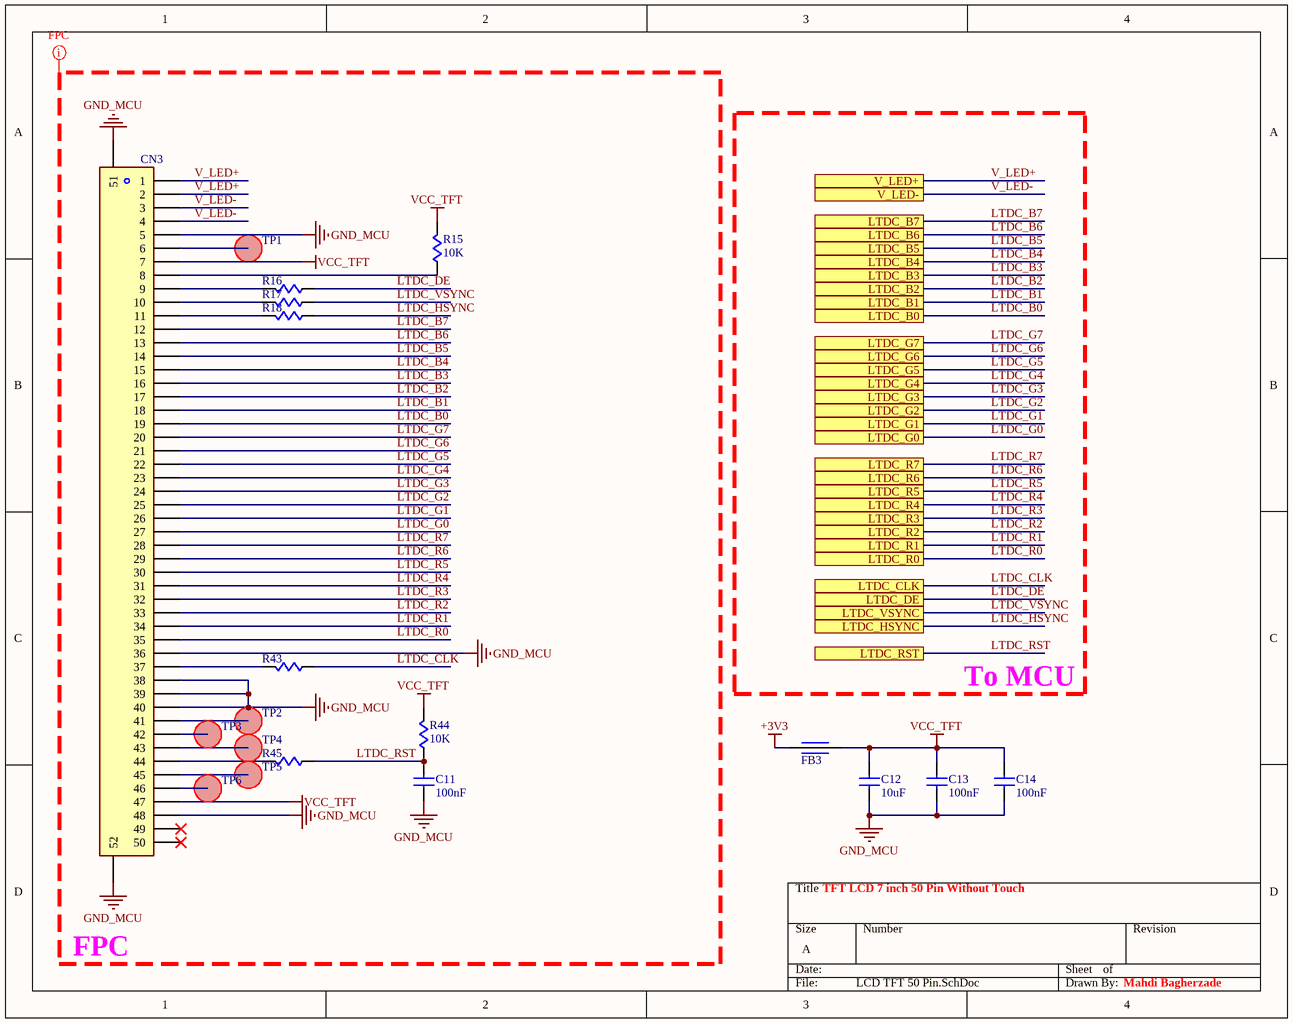
[diagram p3: LCD TFT 50 Pin.SchDoc]

### Parts
C11  value 100nF  [C-0805]  (hidden comment: CAP Cer 100nF-50V-X7R-SMD)
C12  value 10uF  [C-0805]  (hidden comment: CAP Cer 10uF-50V-X7R-SMD)
C13  value 100nF  [C-0805]  (hidden comment: CAP Cer 100nF-50V-X7R-SMD)
C14  value 100nF  [C-0805]  (hidden comment: CAP Cer 100nF-50V-X7R-SMD)
CN3  Connector FPC Right-0.5mm-50 Pin  [CN-FPC-50-0.5mm-hor]  (value not drawn)
FB3  Ferrite Bead SMD  [FB-0805]  (value not drawn)
R15  value 10K  [R-0805]  (hidden comment: RES 10K-5%-1/8W-SMD)
R16  RES 10R-5%-1/8W-SMD  [R-0805]  (value not drawn)
R17  RES 10R-5%-1/8W-SMD  [R-0805]  (value not drawn)
R18  RES 10R-5%-1/8W-SMD  [R-0805]  (value not drawn)
R43  RES 10R-5%-1/8W-SMD  [R-0805]  (value not drawn)
R44  value 10K  [R-0805]  (hidden comment: RES 10K-5%-1/8W-SMD)
R45  RES 10R-5%-1/8W-SMD  [R-0805]  (value not drawn)
TP1  (no value)  [TEST POINT-SMD]  (net tie, no BOM)
TP2  (no value)  [TEST POINT-SMD]  (net tie, no BOM)
TP3  (no value)  [TEST POINT-SMD]  (net tie, no BOM)
TP4  (no value)  [TEST POINT-SMD]  (net tie, no BOM)
TP5  (no value)  [TEST POINT-SMD]  (net tie, no BOM)
TP6  (no value)  [TEST POINT-SMD]  (net tie, no BOM)

### Ports
LTDC_B0 (see Interface[6C]), LTDC_B1 (see Interface[6C]), LTDC_B2 (see Interface[6C], MCU[5B]), LTDC_B3 (see Interface[6C], MCU[3C]), LTDC_B4 (see Interface[6C], MCU[3C]), LTDC_B5 (see Interface[6C], MCU[3A]), LTDC_B6 (see Interface[6B], MCU[5A]), LTDC_B7 (see Interface[6B], MCU[5A]), LTDC_CLK (see Interface[6C], MCU[3C]), LTDC_DE (see Interface[6C], MCU[5C]), LTDC_G0 (see Interface[6C]), LTDC_G1 (see Interface[6C]), LTDC_G2 (see Interface[6C], MCU[3A]), LTDC_G3 (see Interface[6C], MCU[3C]), LTDC_G4 (see Interface[6C], MCU[5A]), LTDC_G5 (see Interface[6C], MCU[5A]), LTDC_G6 (see Interface[6C], MCU[3B]), LTDC_G7 (see Interface[6C], MCU[5B]), LTDC_HSYNC (see Interface[6D], MCU[3B]), LTDC_R0 (see Interface[6C]), LTDC_R1 (see Interface[6C]), LTDC_R2 (see Interface[6C], MCU[3B]), LTDC_R3 (see Interface[6C], MCU[5A]), LTDC_R4 (see Interface[6C], MCU[3A]), LTDC_R5 (see Interface[6C], MCU[3A]), LTDC_R6 (see Interface[6C], MCU[5A]), LTDC_R7 (see Interface[6C], MCU[3C]), LTDC_RST (see Interface[6D], MCU[3B]), LTDC_VSYNC (see Interface[6C], MCU[3A]), V_LED+ (see Interface[6D], MC3202[4B]), V_LED- (see Interface[6D], MC3202[3B])

### Nets
+3V3: FB3.1
GND_MCU: C11.1 C12.2 C13.2 C14.2 CN3.5 CN3.18 CN3.19 CN3.26 CN3.27 CN3.34 CN3.35 CN3.36 CN3.38 CN3.39 CN3.40 CN3.48 CN3.51 CN3.52 ; port LTDC_B0, port LTDC_B1, port LTDC_G0, port LTDC_G1, port LTDC_R0, port LTDC_R1  [also labelled LTDC_B0, LTDC_B1, LTDC_G0, LTDC_G1, LTDC_R0, LTDC_R1]
VCC_TFT: C12.1 C13.1 C14.1 CN3.7 CN3.47 FB3.2 R15.2 R44.2
LTDC_B2: CN3.17 ; port LTDC_B2
LTDC_B3: CN3.16 ; port LTDC_B3
LTDC_B4: CN3.15 ; port LTDC_B4
LTDC_B5: CN3.14 ; port LTDC_B5
LTDC_B6: CN3.13 ; port LTDC_B6
LTDC_B7: CN3.12 ; port LTDC_B7
LTDC_CLK: R43.1 ; port LTDC_CLK
LTDC_DE: R16.1 ; port LTDC_DE
LTDC_G2: CN3.25 ; port LTDC_G2
LTDC_G3: CN3.24 ; port LTDC_G3
LTDC_G4: CN3.23 ; port LTDC_G4
LTDC_G5: CN3.22 ; port LTDC_G5
LTDC_G6: CN3.21 ; port LTDC_G6
LTDC_G7: CN3.20 ; port LTDC_G7
LTDC_HSYNC: R18.1 ; port LTDC_HSYNC
LTDC_R2: CN3.33 ; port LTDC_R2
LTDC_R3: CN3.32 ; port LTDC_R3
LTDC_R4: CN3.31 ; port LTDC_R4
LTDC_R5: CN3.30 ; port LTDC_R5
LTDC_R6: CN3.29 ; port LTDC_R6
LTDC_R7: CN3.28 ; port LTDC_R7
LTDC_RST: C11.2 R44.1 R45.1 ; port LTDC_RST
LTDC_VSYNC: R17.1 ; port LTDC_VSYNC
V_LED+: CN3.1 CN3.2 ; port V_LED+
V_LED-: CN3.3 CN3.4 ; port V_LED-
NetCN3_6: CN3.6 TP1.1(TP)
NetCN3_8: CN3.8 R15.1
NetCN3_9: CN3.9 R16.2
NetCN3_10: CN3.10 R17.2
NetCN3_11: CN3.11 R18.2
NetCN3_37: CN3.37 R43.2
NetCN3_41: CN3.41 TP2.1(TP)
NetCN3_42: CN3.42 TP3.1(TP)
NetCN3_43: CN3.43 TP4.1(TP)
NetCN3_44: CN3.44 R45.2
NetCN3_45: CN3.45 TP5.1(TP)
NetCN3_46: CN3.46 TP6.1(TP)

Not connected (* = marked no-connect by the designer): CN3 49* 50*

### Layout directives
net class FPC: GND_MCU, LTDC_B0, LTDC_B1, LTDC_B2, LTDC_B3, LTDC_B4, LTDC_B5, LTDC_B6, LTDC_B7, LTDC_CLK, LTDC_DE, LTDC_G0, LTDC_G1, LTDC_G2, LTDC_G3, LTDC_G4, LTDC_G5, LTDC_G6, LTDC_G7, LTDC_HSYNC, LTDC_R0, LTDC_R1, LTDC_R2, LTDC_R3, LTDC_R4, LTDC_R5, LTDC_R6, LTDC_R7, LTDC_RST, LTDC_VSYNC, V_LED+, V_LED-, VCC_TFT

### Notes on the sheet
- To MCU
- TFT LCD 7 inch 50 Pin Without Touch
- FPC
- Mahdi Bagherzade

### Library data of the parts
C11-C14 = CAP-CER: as C41 on sheet Interface; Publisher: Mahdi Bagherzadeh; ComponentLink1Description: Linkedin; ComponentLink1URL: https://ir.linkedin.com/in/mahdi-bagherzade; Published Date: 9-15-2024
CN3 = CN-FPC-50pin: CONNECTOR; Phone Number: 0915 8700 314; Publisher: Mahdi Bagherzadeh; ComponentLink1Description: Linkedin; ComponentLink1URL: https://ir.linkedin.com/in/mahdi-bagherzade; Published Date: 9-15-2024; Size: 0.5mm-50 Pin; Type: Right
FB3 = FERRITE BEAD: INDUCATOR; Phone Number: 0915 8700 314; Publisher: Mahdi Bagherzadeh; ComponentLink1Description: Linkedin; ComponentLink1URL: https://ir.linkedin.com/in/mahdi-bagherzade; Published Date: 9-15-2024; Type: SMD
R15 R44 = RES: RESISTOR; Phone Number: 0915 8700 314; Power: 1/8W; Tolerance: 5%; Publisher: Mahdi Bagherzadeh; ComponentLink1Description: Linkedin; ComponentLink1URL: https://ir.linkedin.com/in/mahdi-bagherzade; Published Date: 9-15-2024; Type: SMD
R16-R18 R43 R45 = RES: RESISTOR; Phone Number: 0915 8700 314; VALUE: 10R; Power: 1/8W; Tolerance: 5%; Publisher: Mahdi Bagherzadeh; ComponentLink1Description: Linkedin; ComponentLink1URL: https://ir.linkedin.com/in/mahdi-bagherzade; Published Date: 9-15-2024; Type: SMD
TP1-TP6 = TEST PIONT: Phone Number: 0915 8700 314; Publisher: Mahdi Bagherzadeh; ComponentLink1Description: Linkedin; ComponentLink1URL: https://ir.linkedin.com/in/mahdi-bagherzade; Published Date: 9-15-2024

## Sheet W25Q32.SchDoc
size A; SheetNumber: 10; SheetTotal: 12
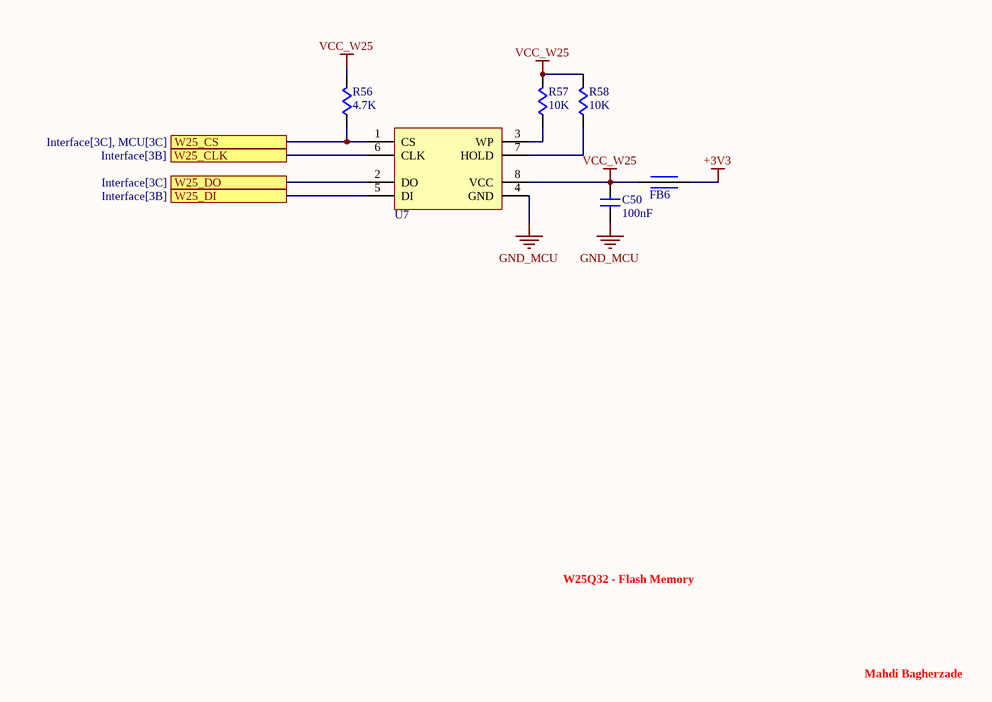
[diagram p4: W25Q32.SchDoc]

### Parts
C50  value 100nF  [C-0805]  (hidden comment: CAP Cer 100nF-50V-X7R-SMD)
FB6  Ferrite Bead SMD  [FB-0805]  (value not drawn)
R56  value 4.7K  [R-0805]  (hidden comment: RES 4.7K-5%-1/8W-SMD)
R57  value 10K  [R-0805]  (hidden comment: RES 10K-5%-1/8W-SMD)
R58  value 10K  [R-0805]  (hidden comment: RES 10K-5%-1/8W-SMD)
U7  IC W25Qxx-SMD  [SOIC8-W]  (value not drawn)

### Ports
W25_CLK (see Interface[3B]), W25_CS (see Interface[3C], MCU[3C]), W25_DI (see Interface[3B]), W25_DO (see Interface[3C])

### Nets
+3V3: FB6.1
GND_MCU: C50.1 U7.4(GND)
VCC_W25: C50.2 FB6.2 R56.2 R57.2 R58.2 U7.8(VCC)
NetR56_1: R56.1 U7.1(CS) ; port W25_CS
NetR57_1: R57.1 U7.3(WP)
NetR58_1: R58.1 U7.7(HOLD)
NetU2_4: U7.2(DO) ; port W25_DO
NetU2_5: U7.5(DI) ; port W25_DI
NetU2_6: U7.6(CLK) ; port W25_CLK

### Notes on the sheet
- W25Q32 - Flash Memory
- Mahdi Bagherzade

### Library data of the parts
C50 = CAP-CER: as C41 on sheet Interface; Publisher: Mahdi Bagherzadeh; ComponentLink1Description: Linkedin; ComponentLink1URL: https://ir.linkedin.com/in/mahdi-bagherzade; Published Date: 9-15-2024
FB6 = FERRITE BEAD: INDUCATOR; Phone Number: 0915 8700 314; Publisher: Mahdi Bagherzadeh; ComponentLink1Description: Linkedin; ComponentLink1URL: https://ir.linkedin.com/in/mahdi-bagherzade; Published Date: 9-15-2024; Type: SMD
R56-R58 = RES: as R15 on sheet LCD TFT 50 Pin; Publisher: Mahdi Bagherzadeh; ComponentLink1Description: Linkedin; ComponentLink1URL: https://ir.linkedin.com/in/mahdi-bagherzade; Published Date: 9-15-2024; Type: SMD
U7 = W25Qxx: IC; Phone Number: 0915 8700 314; Publisher: Mahdi Bagherzadeh; ComponentLink1Description: Linkedin; ComponentLink1URL: https://ir.linkedin.com/in/mahdi-bagherzade; Published Date: 9-15-2024; Code: W25Qxx; Type: SMD

## Sheet EEPROM.SchDoc
size A; SheetNumber: 4; SheetTotal: 12
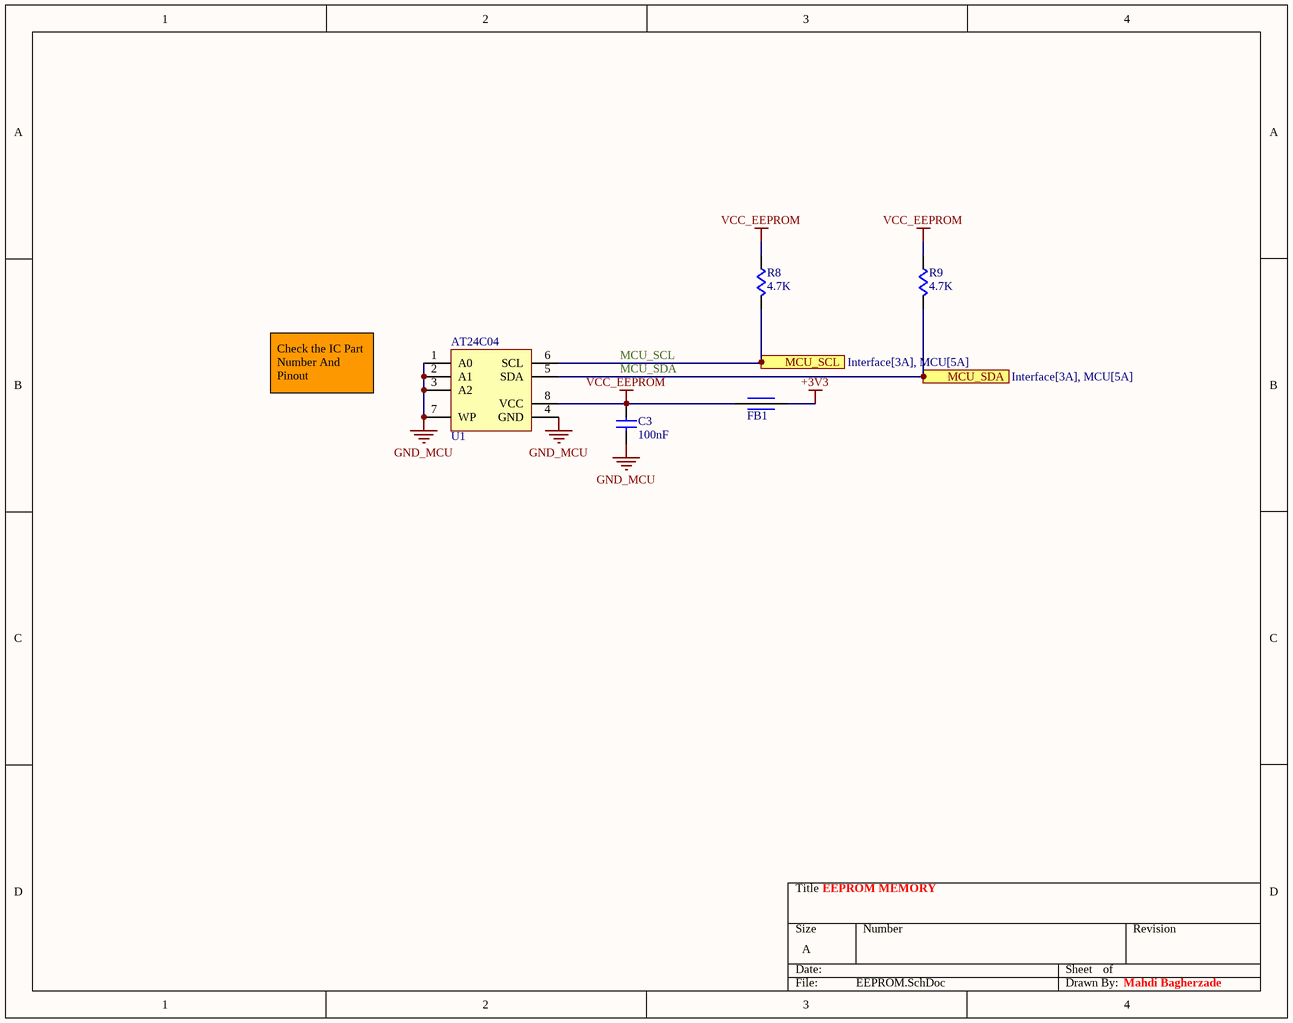
[diagram p5: EEPROM.SchDoc]

### Parts
C3  value 100nF  [C-0805]  (hidden comment: CAP Cer 100nF-50V-X7R-SMD)
FB1  Ferrite Bead SMD  [FB-0805]  (value not drawn)
R8  value 4.7K  [R-0805]  (hidden comment: RES 4.7K-5%-1/8W-SMD)
R9  value 4.7K  [R-0805]  (hidden comment: RES 4.7K-5%-1/8W-SMD)
U1  IC AT24C04-SMD  [SOIC8]  (value not drawn)

### Ports
MCU_SCL (see Interface[3A], MCU[5A]), MCU_SDA (see Interface[3A], MCU[5A])

### Nets
+3V3: FB1.2
GND_MCU: C3.2 U1.1(A0) U1.2(A1) U1.3(A2) U1.4(GND) U1.7(WP)
VCC_EEPROM: C3.1 FB1.1 R8.1 R9.1 U1.8(VCC)
MCU_SCL: R8.2 U1.6(SCL) ; port MCU_SCL
MCU_SDA: R9.2 U1.5(SDA) ; port MCU_SDA

### Notes on the sheet
- Check the IC Part Number And Pinout
- EEPROM MEMORY
- Mahdi Bagherzade

### Library data of the parts
C3 = CAP-CER: as C41 on sheet Interface; Publisher: Mahdi Bagherzadeh; ComponentLink1Description: Linkedin; ComponentLink1URL: https://ir.linkedin.com/in/mahdi-bagherzade; Published Date: 9-15-2024
FB1 = FERRITE BEAD: INDUCATOR; Phone Number: 0915 8700 314; Publisher: Mahdi Bagherzadeh; ComponentLink1Description: Linkedin; ComponentLink1URL: https://ir.linkedin.com/in/mahdi-bagherzade; Published Date: 9-15-2024; Type: SMD
R8 R9 = RES: as R15 on sheet LCD TFT 50 Pin; Publisher: Mahdi Bagherzadeh; ComponentLink1Description: Linkedin; ComponentLink1URL: https://ir.linkedin.com/in/mahdi-bagherzade; Published Date: 9-15-2024; Type: SMD
U1 = AT24C04: IC; Phone Number: 0915 8700 314; Publisher: Mahdi Bagherzadeh; ComponentLink1Description: Linkedin; ComponentLink1URL: https://ir.linkedin.com/in/mahdi-bagherzade; Published Date: 9-15-2024; Code: AT24C04; Type: SMD

## Sheet Digital Input.SchDoc
size A; SheetNumber: 2; SheetTotal: 12
Used 2 times, as channels KEY1, KEY2. Parts and nets are listed once, with the designators drawn on the sheet.
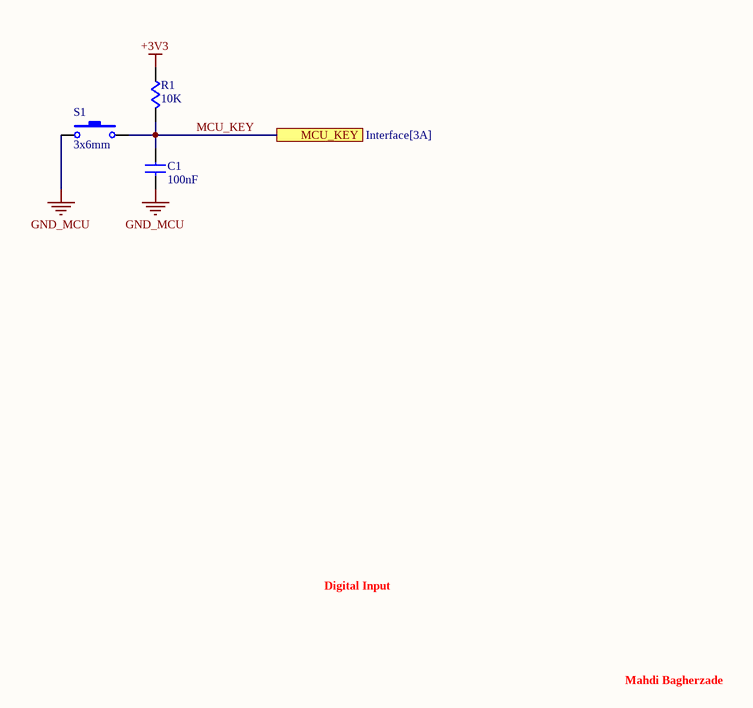
[diagram p6: Digital Input.SchDoc]

### Parts
C1  value 100nF  [C-0805]  (hidden comment: CAP Cer 100nF-50V-X7R-SMD)
R1  value 10K  [R-0805]  (hidden comment: RES 10K-5%-1/8W-SMD)
S1  Size: 3x6mm  [SW-SMD-2pin-3x6]  (hidden comment: Push Button 3x6mm-2Pin-SMD)

### Ports
MCU_KEY (see Interface[3A])

### Nets
+3V3: R1.1
GND_MCU: C1.2 S1.1
MCU_KEY: C1.1 R1.2 S1.2 ; port MCU_KEY

### Channels
KEY1: designators end in A; ports MCU_KEY=MCU_KEY_KEY1
KEY2: designators end in B; ports MCU_KEY=MCU_KEY_KEY2

### Notes on the sheet
- Digital Input
- Mahdi Bagherzade

### Library data of the parts
C1 = CAP-CER: as C41 on sheet Interface; Publisher: Mahdi Bagherzadeh; ComponentLink1Description: Linkedin; ComponentLink1URL: https://ir.linkedin.com/in/mahdi-bagherzade; Published Date: 9-15-2024
R1 = RES: as R51 on sheet Interface; Publisher: Mahdi Bagherzadeh; ComponentLink1Description: Linkedin; ComponentLink1URL: https://ir.linkedin.com/in/mahdi-bagherzade; Published Date: 9-15-2024; Type: SMD
S1 = PUSH BUTTON: SWITCH; Phone Number: 0915 8700 314; Publisher: Mahdi Bagherzadeh; ComponentLink1Description: Linkedin; ComponentLink1URL: https://ir.linkedin.com/in/mahdi-bagherzade; Published Date: 9-15-2024; Type: 2Pin-SMD

## Sheet Power.SchDoc
size A4; SheetNumber: 13; SheetTotal: 13
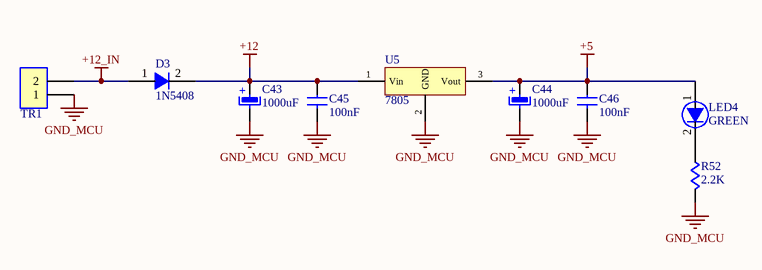
[diagram p7: Power.SchDoc]

### Parts
C43  value 1000uF  [CAP-Elec-10x25-5]  (hidden comment: CAP Elec 1000uF-25V-10x25-THD)
C44  value 1000uF  [cap-Elec-5x7]  (hidden comment: CAP Elec 1000uF-10V-5x7mm-THD)
C45  value 100nF  [C-0805]  (hidden comment: CAP Cer 100nF-50V-X7R-SMD)
C46  value 100nF  [C-0805]  (hidden comment: CAP Cer 100nF-50V-X7R-SMD)
D3  Code: 1N5408  [D-DO214]  (hidden comment: Diode 1N5408-SMD)
LED4  Color: GREEN  [LED-1206-Y]  (hidden comment: LED GREEN-1206-SMD)
R52  value 2.2K  [R-0805]  (hidden comment: RES 2.2K-5%-1/8W-SMD)
TR1  Terminal KF301-2Pin-5.08mm-Straight  [KF301-2pin]  (value not drawn)
U5  Code: 7805  [TO220-HEARSINK-1]  (hidden comment: Reg 7805-5V-THD)

### Nets
+5: C44.1 C46.1 LED4.1(A) U5.3(Vout)
+12: C43.1 C45.1 D3.2(C) U5.1(Vin)
+12_IN: D3.1(A) TR1.2
GND_MCU: C43.2 C44.2 C45.2 C46.2 R52.2 TR1.1 U5.2(GND)
NetLED4_2: LED4.2(C) R52.1

### Notes on the sheet
- (in symbol CAP-ELEC) +

### Library data of the parts
C43 = CAP-ELEC: CAPACITOR; Phone Number: 0915 8700 314; Voltage: 25V; Type: THD; Publisher: Mahdi Bagherzadeh; ComponentLink1Description: Linkedin; ComponentLink1URL: https://ir.linkedin.com/in/mahdi-bagherzade; Published Date: 9-15-2024; Size: 10x25
C44 = CAP-ELEC: CAPACITOR; Phone Number: 0915 8700 314; Voltage: 10V; Type: THD; Publisher: Mahdi Bagherzadeh; ComponentLink1Description: Linkedin; ComponentLink1URL: https://ir.linkedin.com/in/mahdi-bagherzade; Published Date: 9-15-2024; Size: 5x7mm
C45 C46 = CAP-CER: as C41 on sheet Interface; Publisher: Mahdi Bagherzadeh; ComponentLink1Description: Linkedin; ComponentLink1URL: https://ir.linkedin.com/in/mahdi-bagherzade; Published Date: 9-15-2024
D3 = DIODE: Phone Number: 0915 8700 314; Type: SMD; Publisher: Mahdi Bagherzadeh; ComponentLink1Description: Linkedin; ComponentLink1URL: https://ir.linkedin.com/in/mahdi-bagherzade; Published Date: 9-15-2024
LED4 = LED: Phone Number: 0915 8700 314; Type: SMD; Publisher: Mahdi Bagherzadeh; ComponentLink1Description: Linkedin; ComponentLink1URL: https://ir.linkedin.com/in/mahdi-bagherzade; Published Date: 9-15-2024; Size: 1206
R52 = RES: as R51 on sheet Interface; Publisher: Mahdi Bagherzadeh; ComponentLink1Description: Linkedin; ComponentLink1URL: https://ir.linkedin.com/in/mahdi-bagherzade; Published Date: 9-15-2024; Type: SMD
TR1 = TEMINAL-2pin: TERMINAL; Phone Number: 0915 8700 314; Publisher: Mahdi Bagherzadeh; ComponentLink1Description: Linkedin; ComponentLink1URL: https://ir.linkedin.com/in/mahdi-bagherzade; Published Date: 9-15-2024; Size: 5.08mm; Code: KF301-2Pin; Type: Straight
U5 = 78Mxx: REGULATOR; Phone Number: 0915 8700 314; Voltage: 5V; Publisher: Mahdi Bagherzadeh; ComponentLink1Description: Linkedin; ComponentLink1URL: https://ir.linkedin.com/in/mahdi-bagherzade; Published Date: 9-15-2024; Type: THD

## Sheet Channel.SchDoc
size A; SheetNumber: 3; SheetTotal: 12
Used 8 times, as channels CHANNEL1, CHANNEL2, CHANNEL3, CHANNEL4, CHANNEL5, CHANNEL6, CHANNEL7, CHANNEL8. Parts and nets are listed once, with the designators drawn on the sheet.
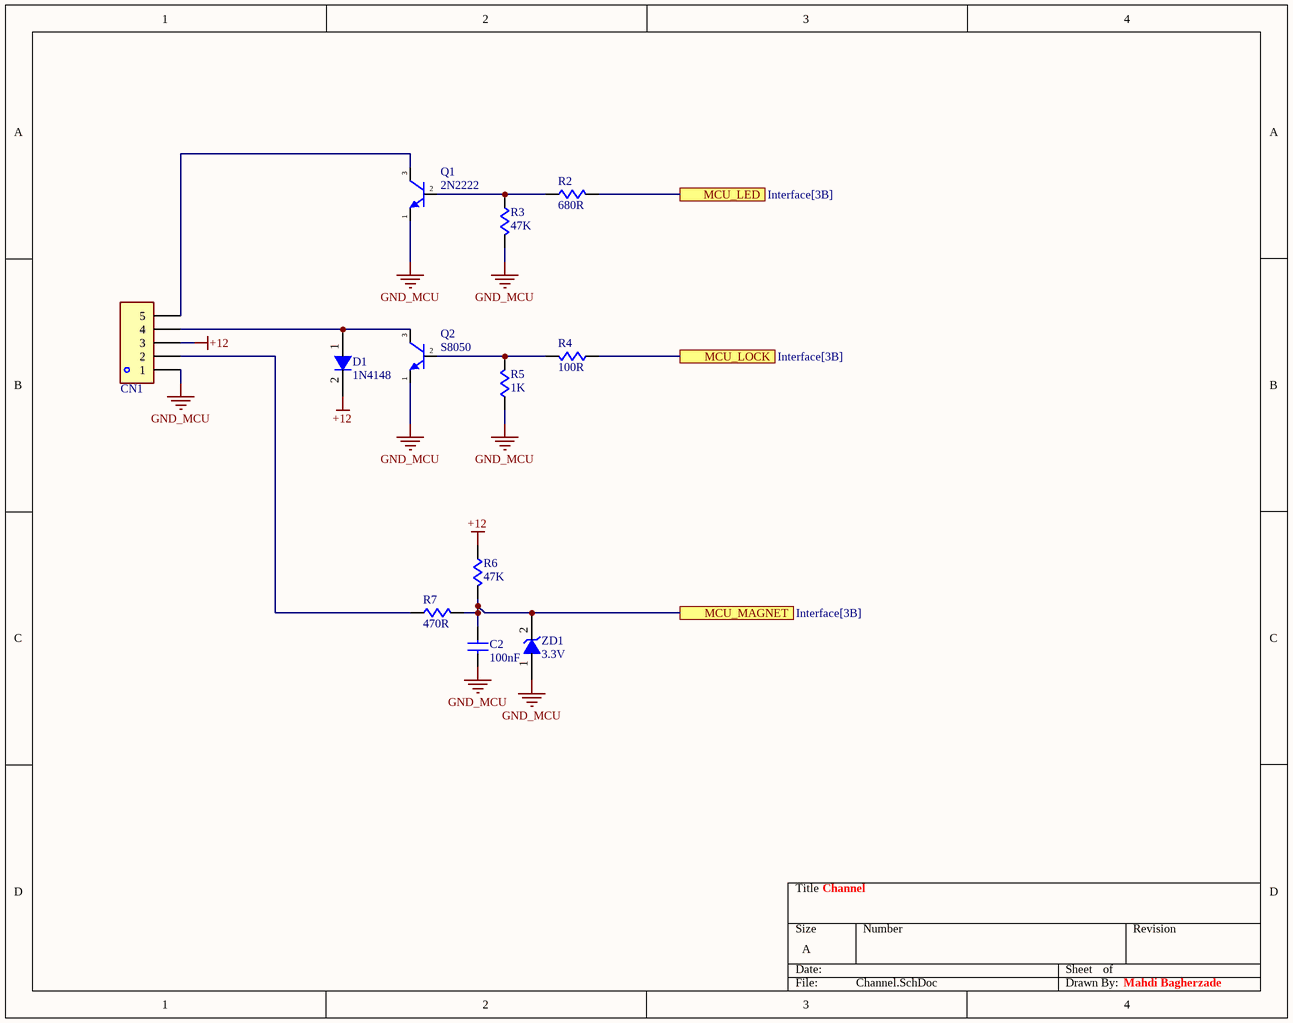
[diagram p8: Channel.SchDoc]

### Parts
C2  value 100nF  [C-0805]  (hidden comment: CAP Cer 100nF-50V-X7R-SMD)
CN1  Connector XH-Straight-THD-2.54mm  [XH-5]  (value not drawn)
D1  Code: 1N4148  [SOD80]  (hidden comment: Diode 1N4148-SMD)
Q1  value 2N2222  [SOT23-213]  (hidden comment: TR 2N2222-SMD)
Q2  value S8050  [SOT23-213]  (hidden comment: TR S8050-SMD)
R2  value 680R  [R-0805]  (hidden comment: RES 680R-5%-1/8W-SMD)
R3  value 47K  [R-0805]  (hidden comment: RES 47K-5%-1/8W-SMD)
R4  value 100R  [R-0805]  (hidden comment: RES 100R-5%-1/8W-SMD)
R5  value 1K  [R-0805]  (hidden comment: RES 1K-5%-1/8W-SMD)
R6  value 47K  [R-0805]  (hidden comment: RES 47K-5%-1/8W-SMD)
R7  value 470R  [R-0805]  (hidden comment: RES 470R-5%-1/8W-SMD)
ZD1  Voltage: 3.3V  [SOD80]  (hidden comment: Zener -3.3V-SMD)

### Ports
MCU_LED (see Interface[3B]), MCU_LOCK (see Interface[3B]), MCU_MAGNET (see Interface[3B])

### Nets
+12: CN1.3 D1.2(C) R6.1
GND_MCU: C2.2 CN1.1 Q1.1(E) Q2.1(E) R3.2 R5.1 ZD1.1(A)
MCU_LED: R2.2 ; port MCU_LED
MCU_LOCK: R4.1 ; port MCU_LOCK
MCU_MAGNET: C2.1 R6.2 R7.2 ZD1.2(C) ; port MCU_MAGNET
NetCN1_2: CN1.2 R7.1
NetCN1_4: CN1.4 D1.1(A) Q2.3(C)
NetCN1_5: CN1.5 Q1.3(C)
NetQ1_2: Q1.2(B) R2.1 R3.1
NetQ2_2: Q2.2(B) R4.2 R5.2

### Channels
CHANNEL1: designators end in A; ports MCU_LED=MCU_LED1 MCU_LOCK=MCU_LOCK1 MCU_MAGNET=MCU_MAGNET1
CHANNEL2: designators end in B; ports MCU_LED=MCU_LED2 MCU_LOCK=MCU_LOCK2 MCU_MAGNET=MCU_MAGNET2
CHANNEL3: designators end in C; ports MCU_LED=MCU_LED3 MCU_LOCK=MCU_LOCK3 MCU_MAGNET=MCU_MAGNET3
CHANNEL4: designators end in D; ports MCU_LED=MCU_LED4 MCU_LOCK=MCU_LOCK4 MCU_MAGNET=MCU_MAGNET4
CHANNEL5: designators end in E; ports MCU_LED=MCU_LED5 MCU_LOCK=MCU_LOCK5 MCU_MAGNET=MCU_MAGNET5
CHANNEL6: designators end in F; ports MCU_LED=MCU_LED6 MCU_LOCK=MCU_LOCK6 MCU_MAGNET=MCU_MAGNET6
CHANNEL7: designators end in G; ports MCU_LED=MCU_LED7 MCU_LOCK=MCU_LOCK7 MCU_MAGNET=MCU_MAGNET7
CHANNEL8: designators end in H; ports MCU_LED=MCU_LED8 MCU_LOCK=MCU_LOCK8 MCU_MAGNET=MCU_MAGNET8

### Notes on the sheet
- Channel
- Mahdi Bagherzade

### Library data of the parts
C2 = CAP-CER: as C41 on sheet Interface; Publisher: Mahdi Bagherzadeh; ComponentLink1Description: Linkedin; ComponentLink1URL: https://ir.linkedin.com/in/mahdi-bagherzade; Published Date: 9-15-2024
CN1 = CN-5pin: CONNECTOR; Phone Number: 0915 8700 314; Value: XH; Publisher: Mahdi Bagherzadeh; ComponentLink1Description: Linkedin; ComponentLink1URL: https://ir.linkedin.com/in/mahdi-bagherzade; Published Date: 9-15-2024; Type: Straight-THD; Size: 2.54mm
D1 = DIODE: Phone Number: 0915 8700 314; Type: SMD; Publisher: Mahdi Bagherzadeh; ComponentLink1Description: Linkedin; ComponentLink1URL: https://ir.linkedin.com/in/mahdi-bagherzade; Published Date: 9-15-2024
Q1 = 2N2222: TRANSISTOR; Phone Number: 0915 8700 314; Type: SMD; Code: 1P; Publisher: Mahdi Bagherzadeh; ComponentLink1Description: Linkedin; ComponentLink1URL: https://ir.linkedin.com/in/mahdi-bagherzade; Published Date: 9-15-2024
Q2 = S8050: TRANSISTOR; Phone Number: 0915 8700 314; Code: J3Y; Type: SMD; Publisher: Mahdi Bagherzadeh; ComponentLink1Description: Linkedin; ComponentLink1URL: https://ir.linkedin.com/in/mahdi-bagherzade; Published Date: 9-15-2024
R2-R7 = RES: as R51 on sheet Interface; Publisher: Mahdi Bagherzadeh; ComponentLink1Description: Linkedin; ComponentLink1URL: https://ir.linkedin.com/in/mahdi-bagherzade; Published Date: 9-15-2024; Type: SMD
ZD1 = DIODE-ZENER: DIODE; Phone Number: 0915 8700 314; Power: Minimelf; Publisher: Mahdi Bagherzadeh; ComponentLink1Description: Linkedin; ComponentLink1URL: https://ir.linkedin.com/in/mahdi-bagherzade; Published Date: 9-15-2024; Type: SMD

## Sheet MC3202.SchDoc
size A; SheetNumber: 9; SheetTotal: 13
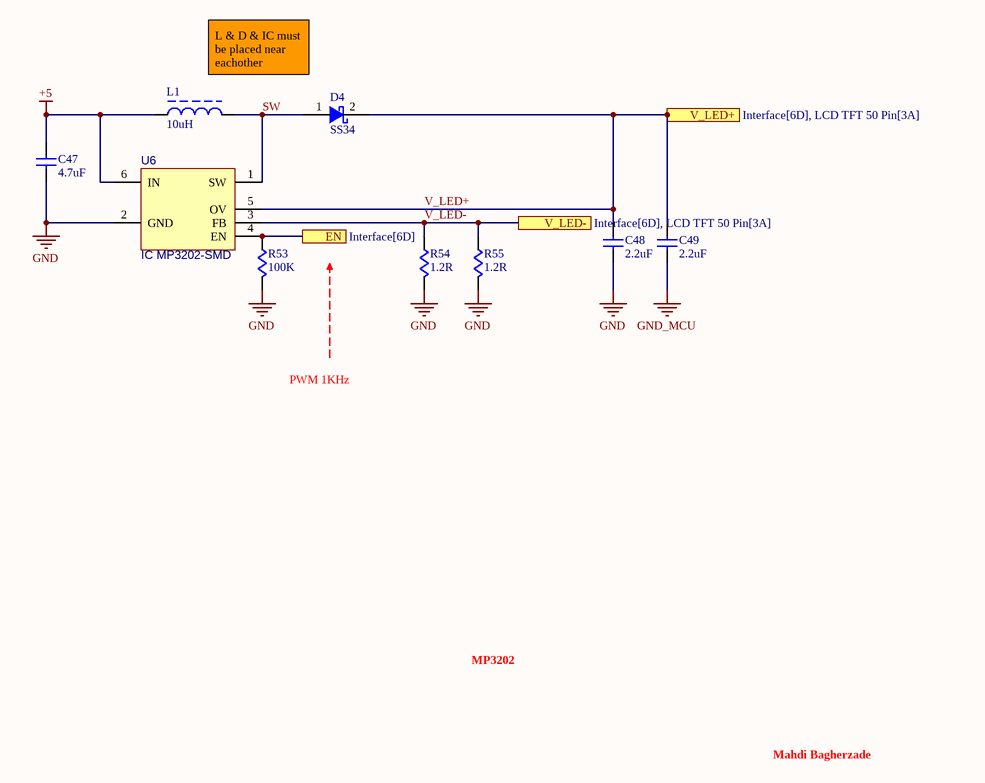
[diagram p9: MC3202.SchDoc]

### Parts
C47  value 4.7uF  [C-0805]  (hidden comment: CAP Cer 4.7uF-16V-X7R-SMD)
C48  value 2.2uF  [C-0805]  (hidden comment: CAP Cer 2.2uF-25V-X7R-SMD)
C49  value 2.2uF  [C-0805]  (hidden comment: CAP Cer 2.2uF-25V-X7R-SMD)
D4  Code: SS34  [D-DO214AB]  (hidden comment: Diode Schottky SS34-SMD)
L1  value 10uH  [IND-SMD-1010]  (hidden comment: IND 10uH-10x10mm-SMD)
R53  value 100K  [R-0805]  (hidden comment: RES 100K-5%-1/8W-SMD)
R54  value 1.2R  [R-1206]  (hidden comment: RES 1.2R-5%-1/8W-SMD)
R55  value 1.2R  [R-1206]  (hidden comment: RES 1.2R-5%-1/8W-SMD)
U6  IC MP3202-SMD  [SOT23-6N]

### Ports
EN (see Interface[6D]), V_LED+ (see Interface[6D], LCD TFT 50 Pin[3A]), V_LED- (see Interface[6D], LCD TFT 50 Pin[3A])

### Nets
+5: C47.1 L1.1 U6.6(IN)
GND: C47.2 C48.2 R53.2 R54.2 R55.2 U6.2(GND)
GND_MCU: C49.2
SW: D4.1(A) L1.2 U6.1(SW)
V_LED+: C48.1 C49.1 D4.2(C) U6.5(OV) ; port V_LED+
V_LED-: R54.1 R55.1 U6.3(FB) ; port V_LED-
NetR53_1: R53.1 U6.4(EN) ; port EN

### Notes on the sheet
- L & D & IC must be placed near eachother
- PWM 1KHz
- MP3202
- Mahdi Bagherzade

### Library data of the parts
C47 = CAP-CER: CAPACITOR; Phone Number: 0915 8700 314; Voltage: 16V; Tolerance: X7R; Type: SMD; Publisher: Mahdi Bagherzadeh; ComponentLink1Description: Linkedin; ComponentLink1URL: https://ir.linkedin.com/in/mahdi-bagherzade; Published Date: 9-15-2024
C48 C49 = CAP-CER: CAPACITOR; Phone Number: 0915 8700 314; Voltage: 25V; Tolerance: X7R; Type: SMD; Publisher: Mahdi Bagherzadeh; ComponentLink1Description: Linkedin; ComponentLink1URL: https://ir.linkedin.com/in/mahdi-bagherzade; Published Date: 9-15-2024
D4 = DIODE-SCHOTTKY: DIODE; Phone Number: 0915 8700 314; Type: SMD; Publisher: Mahdi Bagherzadeh; ComponentLink1Description: Linkedin; ComponentLink1URL: https://ir.linkedin.com/in/mahdi-bagherzade; Published Date: 9-15-2024
L1 = INDUCATOR: Phone Number: 0915 8700 314; Type: SMD; Publisher: Mahdi Bagherzadeh; ComponentLink1Description: Linkedin; ComponentLink1URL: https://ir.linkedin.com/in/mahdi-bagherzade; Published Date: 9-15-2024; Size: 10x10mm
R53-R55 = RES: as R51 on sheet Interface; Publisher: Mahdi Bagherzadeh; ComponentLink1Description: Linkedin; ComponentLink1URL: https://ir.linkedin.com/in/mahdi-bagherzade; Published Date: 9-15-2024; Type: SMD
U6 = MP3202: IC; Phone Number: 0915 8700 314; Publisher: Mahdi Bagherzadeh; Published Date: 7-2-2026; Code: MP3202; Type: SMD